# EAGLE design Titan_Balancer (EAGLE 9.6.2)

## Sheet 1 of 3: Connectors
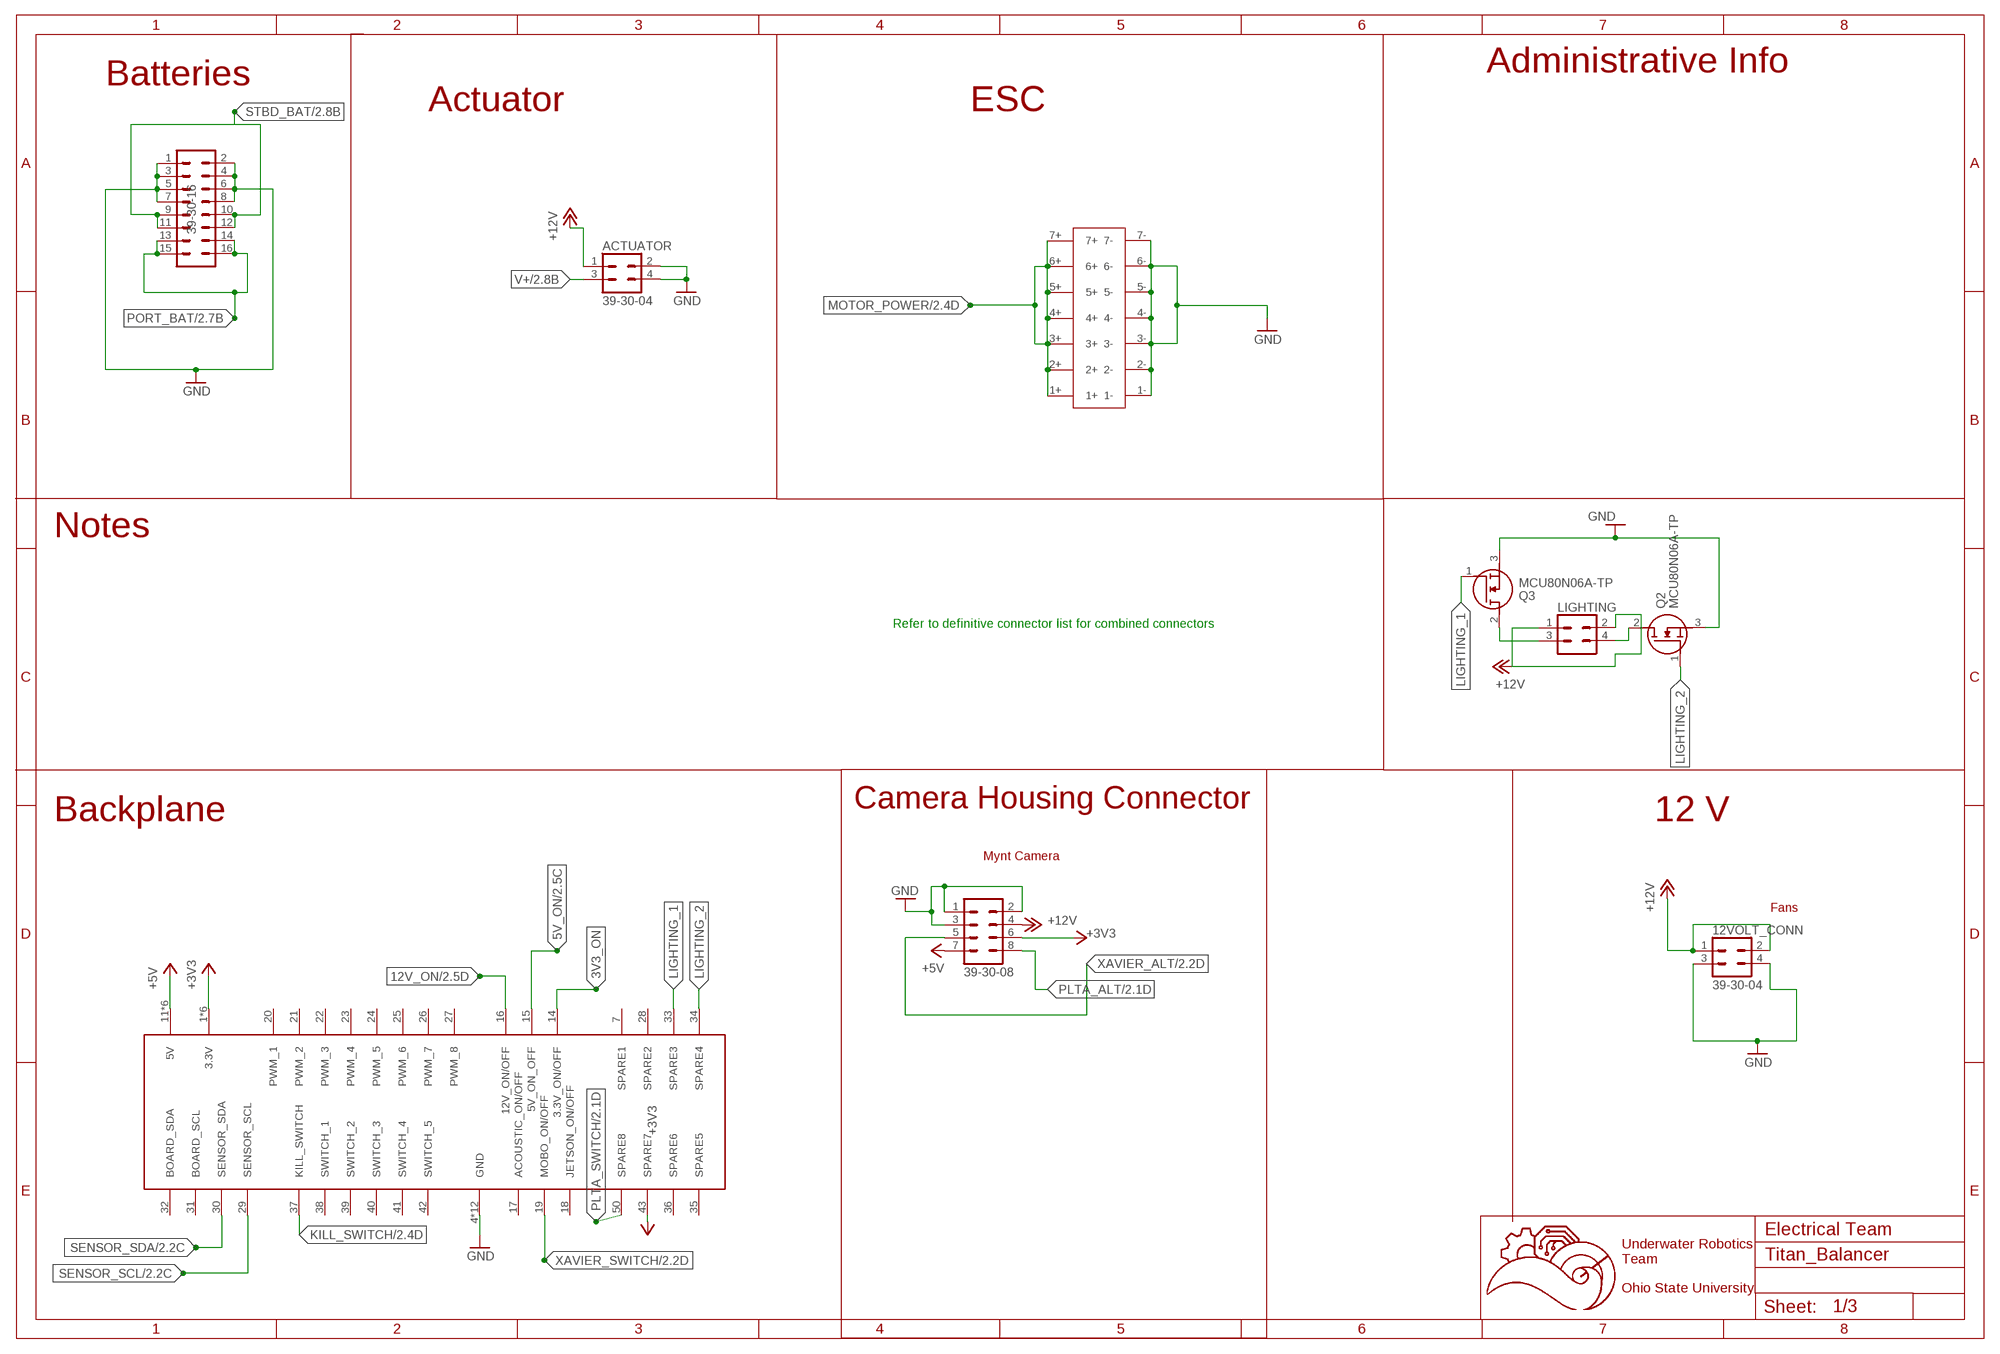
[diagram p0: schematic, sheet 1]

### Parts
12VOLT_CONN  39-30-04  [39-30-?04?]
ACTUATOR  39-30-04  [39-30-?04?]
BATTERYCONNECTOR  39-30-16  [39-30-?16?]
ESC_CONN  14PIN-VERT  [14PIN_VERT]
LIGHTING  39-30-04  [39-30-?04?]
MYNT_XAVIER_PLTA  39-30-08  [39-30-?08?]
Q2  MCU80N06A-TP  FDD8453LZ  [FDD8453LZ]
Q3  MCU80N06A-TP  FDD8453LZ  [FDD8453LZ]
U$1  5530843-EDGE  [5530843-6-BOARDFINGERS]

### Nets
3V3_ON: U$1.14(3.3V_ON/OFF)
5V_ON: U$1.15(5V_ON_OFF) ; also sheet 2
12V_ON: U$1.16(12V_ON/OFF) ; also sheet 2
+3V3: MYNT_XAVIER_PLTA.6 U$1.1(3.3V) U$1.2(3.3V) U$1.3(3.3V) U$1.43(SPARE7) U$1.54(3.3V) U$1.55(3.3V) U$1.56(3.3V) ; also sheet 2
+5V: MYNT_XAVIER_PLTA.7 U$1.11(5V) U$1.12(5V) U$1.13(5V) U$1.44(5V) U$1.45(5V) U$1.46(5V) ; also sheet 2
+12V: 12VOLT_CONN.1 12VOLT_CONN.2 ACTUATOR.1 LIGHTING.1 LIGHTING.2 MYNT_XAVIER_PLTA.4 ; also sheet 2
GND: 12VOLT_CONN.3 12VOLT_CONN.4 ACTUATOR.2 ACTUATOR.4 BATTERYCONNECTOR.1 BATTERYCONNECTOR.2 BATTERYCONNECTOR.3 BATTERYCONNECTOR.4 BATTERYCONNECTOR.5 BATTERYCONNECTOR.6 BATTERYCONNECTOR.7 BATTERYCONNECTOR.8 ESC_CONN.1- ESC_CONN.2- ESC_CONN.3- ESC_CONN.4- ESC_CONN.5- ESC_CONN.6- ESC_CONN.7- MYNT_XAVIER_PLTA.1 MYNT_XAVIER_PLTA.2 MYNT_XAVIER_PLTA.3 Q2.3(S) Q3.3(S) U$1.4(GND) U$1.5(GND) U$1.6(GND) U$1.8(GND) U$1.9(GND) U$1.10(GND) U$1.47(GND) U$1.48(GND) U$1.49(GND) U$1.51(GND) U$1.52(GND) U$1.53(GND) ; also sheet 2
KILL_SWITCH: U$1.37(KILL_SWITCH) ; also sheet 2
LIGHTING_1: Q3.1(G) U$1.33(SPARE3)
LIGHTING_2: Q2.1(G) U$1.34(SPARE4)
MOTOR_POWER: ESC_CONN.1+ ESC_CONN.2+ ESC_CONN.3+ ESC_CONN.4+ ESC_CONN.5+ ESC_CONN.6+ ESC_CONN.7+ ; also sheet 2
N$7: LIGHTING.3 Q3.2(D)
N$9: LIGHTING.4 Q2.2(D)
PLTA_ALT: MYNT_XAVIER_PLTA.8 ; also sheet 2
PLTA_SWITCH: U$1.50(SPARE8) ; also sheet 2
PORT_BAT: BATTERYCONNECTOR.13 BATTERYCONNECTOR.14 BATTERYCONNECTOR.15 BATTERYCONNECTOR.16 ; also sheet 2
SENSOR_SCL: U$1.29(SENSOR_SCL) ; also sheet 2
SENSOR_SDA: U$1.30(SENSOR_SDA) ; also sheet 2
STBD_BAT: BATTERYCONNECTOR.9 BATTERYCONNECTOR.10 BATTERYCONNECTOR.11 BATTERYCONNECTOR.12 ; also sheet 2
V+: ACTUATOR.3 ; also sheet 2
XAVIER_ALT: MYNT_XAVIER_PLTA.5 ; also sheet 2
XAVIER_SWITCH: U$1.19(MOBO_ON/OFF) ; also sheet 2
Unconnected: U$1.7(SPARE1) U$1.17(ACOUSTIC_ON/OFF) U$1.18(JETSON_ON/OFF) U$1.20(PWM_1) U$1.21(PWM_2) U$1.22(PWM_3) U$1.23(PWM_4) U$1.24(PWM_5) U$1.25(PWM_6) U$1.26(PWM_7) U$1.27(PWM_8) U$1.28(SPARE2) U$1.31(BOARD_SCL) U$1.32(BOARD_SDA) U$1.35(SPARE5) U$1.36(SPARE6) U$1.38(SWITCH_1) U$1.39(SWITCH_2) U$1.40(SWITCH_3) U$1.41(SWITCH_4) U$1.42(SWITCH_5)

### Notes on the sheet
- Administrative Info
- Batteries
- Actuator | ESC
- Notes
- Refer to definitive connector list for combined connectors
- Camera Housing Connector
- Backplane | 12 V
- Mynt Camera
- Fans
- Electrical Team
- Underwater Robotics
  Team
  
  Ohio State University

## Sheet 2 of 3: Battery Balancer
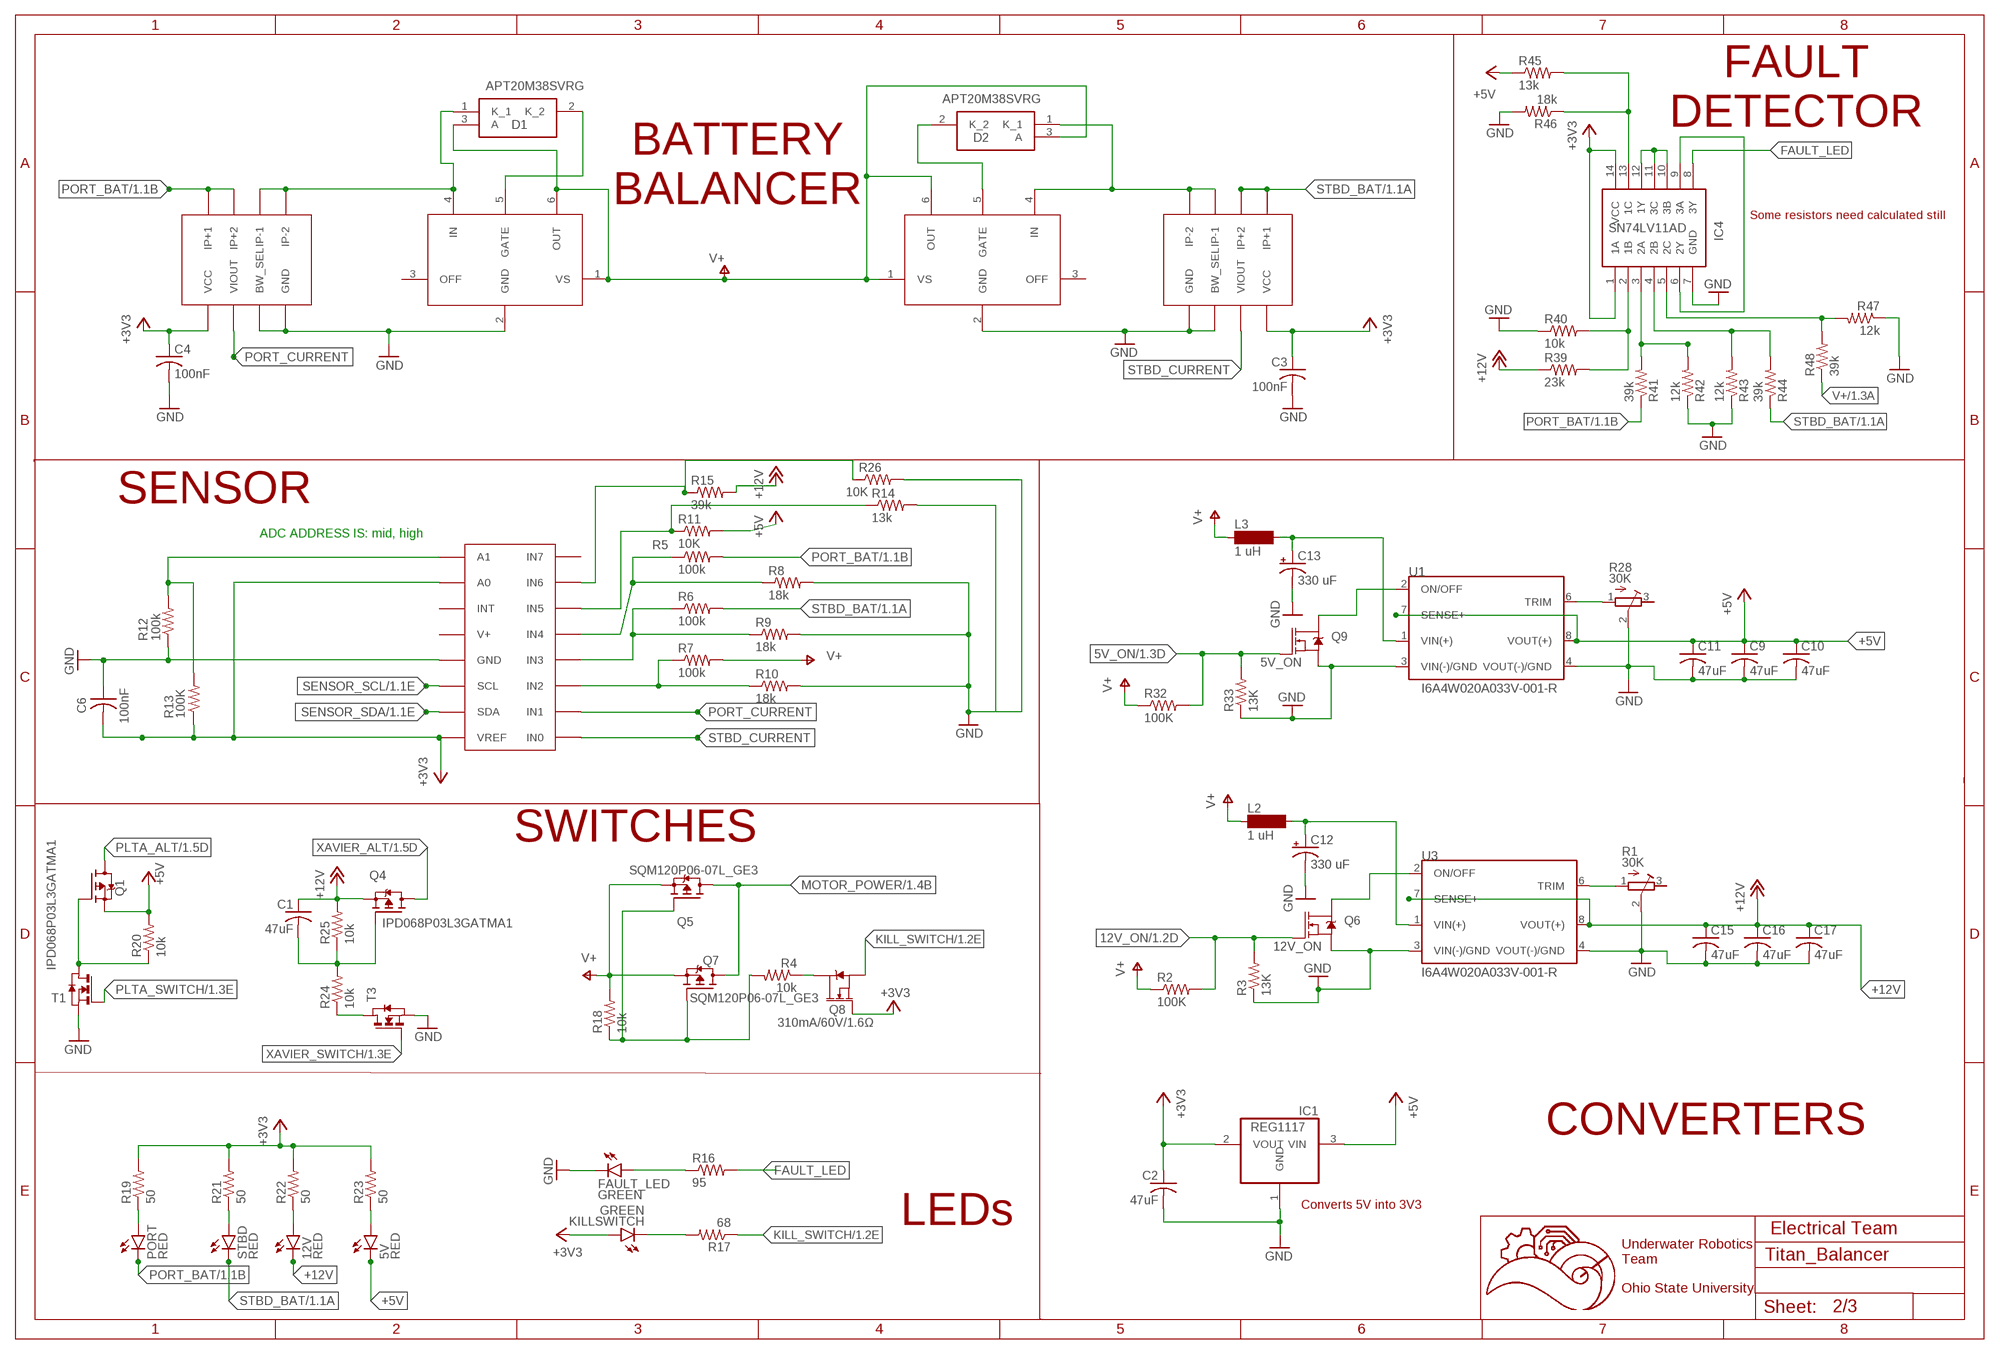
[diagram p1: schematic, sheet 2]

### Parts
5V  RED  LEDSML0603  [SML0603]
12V  RED  LEDSML0603  [SML0603]
C1  47uF  C-USC0603  [C0603]
C2  47uF  C-USC0603  [C0603]
C3  100nF  C-USC0603  [C0603]
C4  100nF  C-USC0603  [C0603]
C6  100nF  C-USC0603  [C0603]
C9  47uF  C-USC0603  [C0603]
C10  47uF  C-USC0603  [C0603]
C11  47uF  C-USC0603  [C0603]
C12  330 uF  CPOL-US153CLV-0810  [153CLV-0810]
C13  330 uF  CPOL-US153CLV-0810  [153CLV-0810]
C15  47uF  C-USC0603  [C0603]
C16  47uF  C-USC0603  [C0603]
C17  47uF  C-USC0603  [C0603]
D1  APT20M38SVRG  APT60DQ60SG  [APT60DQ60SG]
D2  APT20M38SVRG  APT60DQ60SG  [APT60DQ60SG]
FAULT_LED  GREEN  LEDSML0603  [SML0603]
IC1  REG1117  [SOT223]
IC4  SN74LV11AD  [SOIC127P600X175-14N]
KILLSWITCH  GREEN  LEDSML0603  [SML0603]
L2  1 uH  MS85  [MS85]
L3  1 uH  MS85  [MS85]
PORT  RED  LEDSML0603  [SML0603]
Q1  IPD068P03L3GATMA1  SPD30P06PTO252  [TO252]
Q4  IPD068P03L3GATMA1  SPD30P06PTO252  [TO252]
Q5  SQM120P06-07L_GE3  SPB80P06P  [TO263]
Q6  MOSFET-NCH-AO3404A  [SOT23-3]
Q7  SQM120P06-07L_GE3  SPB80P06P  [TO263]
Q8  310mA/60V/1.6Ω  MOSFET-NCH-2N7002PW  [SOT323]
Q9  MOSFET-NCH-AO3404A  [SOT23-3]
R1  30K  R-TRIMM3103  [RTRIM3103]
R2  100K  R-US_R0603  [R0603]
R3  13K  R-US_R0603  [R0603]
R4  10k  R-US_R0603  [R0603]
R5  100k  R-US_R0603  [R0603]
R6  100k  R-US_R0603  [R0603]
R7  100k  R-US_R0603  [R0603]
R8  18k  R-US_R0603  [R0603]
R9  18k  R-US_R0603  [R0603]
R10  18k  R-US_R0603  [R0603]
R11  10K  R-US_R0603  [R0603]
R12  100k  R-US_R0603  [R0603]
R13  100K  R-US_R0603  [R0603]
R14  13k  R-US_R0603  [R0603]
R15  39k  R-US_R0603  [R0603]
R16  95  R-US_R0603  [R0603]
R17  68  R-US_R0603  [R0603]
R18  10k  R-US_R0603  [R0603]
R19  50  R-US_R0603  [R0603]
R20  10k  R-US_R0603  [R0603]
R21  50  R-US_R0603  [R0603]
R22  50  R-US_R0603  [R0603]
R23  50  R-US_R0603  [R0603]
R24  10k  R-US_R0603  [R0603]
R25  10k  R-US_R0603  [R0603]
R26  10K  R-US_R0603  [R0603]
R28  30K  R-TRIMM3103  [RTRIM3103]
R32  100K  R-US_R0603  [R0603]
R33  13K  R-US_R0603  [R0603]
R39  23k  R-US_R0603  [R0603]
R40  10k  R-US_R0603  [R0603]
R41  39k  R-US_R0603  [R0603]
R42  12k  R-US_R0603  [R0603]
R43  12k  R-US_R0603  [R0603]
R44  39k  R-US_R0603  [R0603]
R45  13k  R-US_R0603  [R0603]
R46  18k  R-US_R0603  [R0603]
R47  12k  R-US_R0603  [R0603]
R48  39k  R-US_R0603  [R0603]
STBD  RED  LEDSML0603  [SML0603]
T1  NMOSSOT23  [SOT-23]
T3  NMOSSOT23  [SOT-23]
U1  I6A4W020A033V-001-R  [TDK-LAMBDA_I6A4W020A033V-001-R]
U3  I6A4W020A033V-001-R  [TDK-LAMBDA_I6A4W020A033V-001-R]
U$5  LM5050  [LM5050]
U$6  LM5050  [LM5050]
U$7  ACS722  [SOIC-8]
U$8  ACS722  [SOIC-8]
U$9  ADC128D818  [TSSOP-16]

### Nets
5V_ON: Q9.1(G) R32.2 R33.2 ; also sheet 1
12V_ON: Q6.1(G) R2.2 R3.2 ; also sheet 1
+3V3: C2.1 C3.1 C4.1 C6.2 IC1.2(VOUT) IC4.1(1A) IC4.14(VCC) KILLSWITCH.A Q8.1(G) R13.1 R19.2 R21.2 R22.2 R23.2 U$7.VCC U$8.VCC U$9.A0 U$9.VREF ; also sheet 1
+5V: 5V.C C9.1 C10.1 C11.1 IC1.3(VIN) Q1.2(S) R11.2 R20.2 R45.1 U1.7(SENSE+) U1.8(VOUT(+)) ; also sheet 1
+12V: 12V.C C1.1 C15.1 C16.1 C17.1 Q4.2(S) R15.2 R25.2 R39.1 U3.7(SENSE+) U3.8(VOUT(+)) ; also sheet 1
FAULT_LED: IC4.8(3Y) R16.2
GND: C2.2 C3.2 C4.2 C6.1 C9.2 C10.2 C11.2 C12.- C13.- C15.2 C16.2 C17.2 FAULT_LED.C IC1.1(GND) IC4.7(GND) Q6.2(S) Q9.2(S) R1.2(S) R3.1 R8.2 R9.2 R10.2 R12.1 R14.2 R26.2 R28.2(S) R33.1 R40.1 R42.1 R43.1 R46.2 R47.1 T1.2(S) T3.2(S) U1.3(VIN(-)/GND) U1.4(VOUT(-)/GND) U3.3(VIN(-)/GND) U3.4(VOUT(-)/GND) U$5.2(GND) U$6.2(GND) U$7.BW_SEL U$7.GND U$8.BW_SEL U$8.GND U$9.GND ; also sheet 1
KILL_SWITCH: Q8.2(S) R17.1 ; also sheet 1
MOTOR_POWER: Q5.3(D) Q7.3(D) ; also sheet 1
N$1: FAULT_LED.A R16.1
N$2: D2.2(K_2) U$6.5(GATE)
N$3: D1.1(K_1) U$5.4(IN) U$7.IP-1 U$7.IP-2
N$4: Q5.1(G) Q7.1(G) R4.2 R18.1
N$5: R5.1 R8.1 U$9.IN4
N$6: KILLSWITCH.C R17.2
N$8: Q1.1(G) R20.1 T1.1(D)
N$10: D1.2(K_2) U$5.5(GATE)
N$11: R6.1 R9.1 U$9.IN3
N$12: R7.1 R10.1 U$9.IN2
N$13: Q8.3(D) R4.1
N$14: R24.1 T3.1(D)
N$16: C1.2 Q4.1(G) R24.2 R25.1
N$17: R12.2 R13.2 U$9.A1
N$18: 5V.A R23.1
N$19: D2.1(K_1) U$6.4(IN) U$8.IP-1 U$8.IP-2
N$20: R1.1(A) U3.6(TRIM)
N$21: R28.1(A) U1.6(TRIM)
N$22: Q9.3(D) U1.2(ON/OFF)
N$23: 12V.A R22.1
N$24: C13.+ L3.2 U1.1(VIN(+))
N$25: R21.1 STBD.A
N$26: PORT.A R19.1
N$28: Q6.3(D) U3.2(ON/OFF)
N$29: C12.+ L2.2 U3.1(VIN(+))
N$30: IC4.2(1B) R39.2 R40.2
N$31: IC4.4(2B) R43.2 R44.2
N$32: IC4.13(1C) R45.2 R46.1
N$33: IC4.3(2A) R41.2 R42.2
N$34: IC4.5(2C) R47.2 R48.2
N$36: IC4.6(2Y) IC4.9(3A)
N$37: IC4.10(3B) IC4.11(3C) IC4.12(1Y)
N$39: R11.1 R14.1 U$9.IN5
N$40: R15.1 R26.1 U$9.IN6
PLTA_ALT: Q1.3(D) ; also sheet 1
PLTA_SWITCH: T1.3(G) ; also sheet 1
PORT_BAT: PORT.C R5.2 R41.1 U$7.IP+1 U$7.IP+2 ; also sheet 1
PORT_CURRENT: U$7.VIOUT U$9.IN1
SENSOR_SCL: U$9.SCL ; also sheet 1
SENSOR_SDA: U$9.SDA ; also sheet 1
STBD_BAT: R6.2 R44.1 STBD.C U$8.IP+1 U$8.IP+2 ; also sheet 1
STBD_CURRENT: U$8.VIOUT U$9.IN0
V+: D1.3(A) D2.3(A) L2.1 L3.1 Q5.2(S) Q7.2(S) R2.1 R7.2 R18.2 R32.1 R48.1 U$5.1(VS) U$5.6(OUT) U$6.1(VS) U$6.6(OUT) ; also sheet 1
XAVIER_ALT: Q4.3(D) ; also sheet 1
XAVIER_SWITCH: T3.3(G) ; also sheet 1
Unconnected: R1.3(E) R28.3(E) U$5.3(OFF) U$6.3(OFF) U$9.IN7 U$9.INT U$9.V+

### Notes on the sheet
- FAULT
  DETECTOR
- BATTERY
  BALANCER
- Some resistors need calculated still
- SENSOR
- ADC ADDRESS IS: mid, high
- SWITCHES
- CONVERTERS
- LEDs | Converts 5V into 3V3
- Electrical Team
- Underwater Robotics
  Team
  
  Ohio State University

## Sheet 3 of 3: Parts List
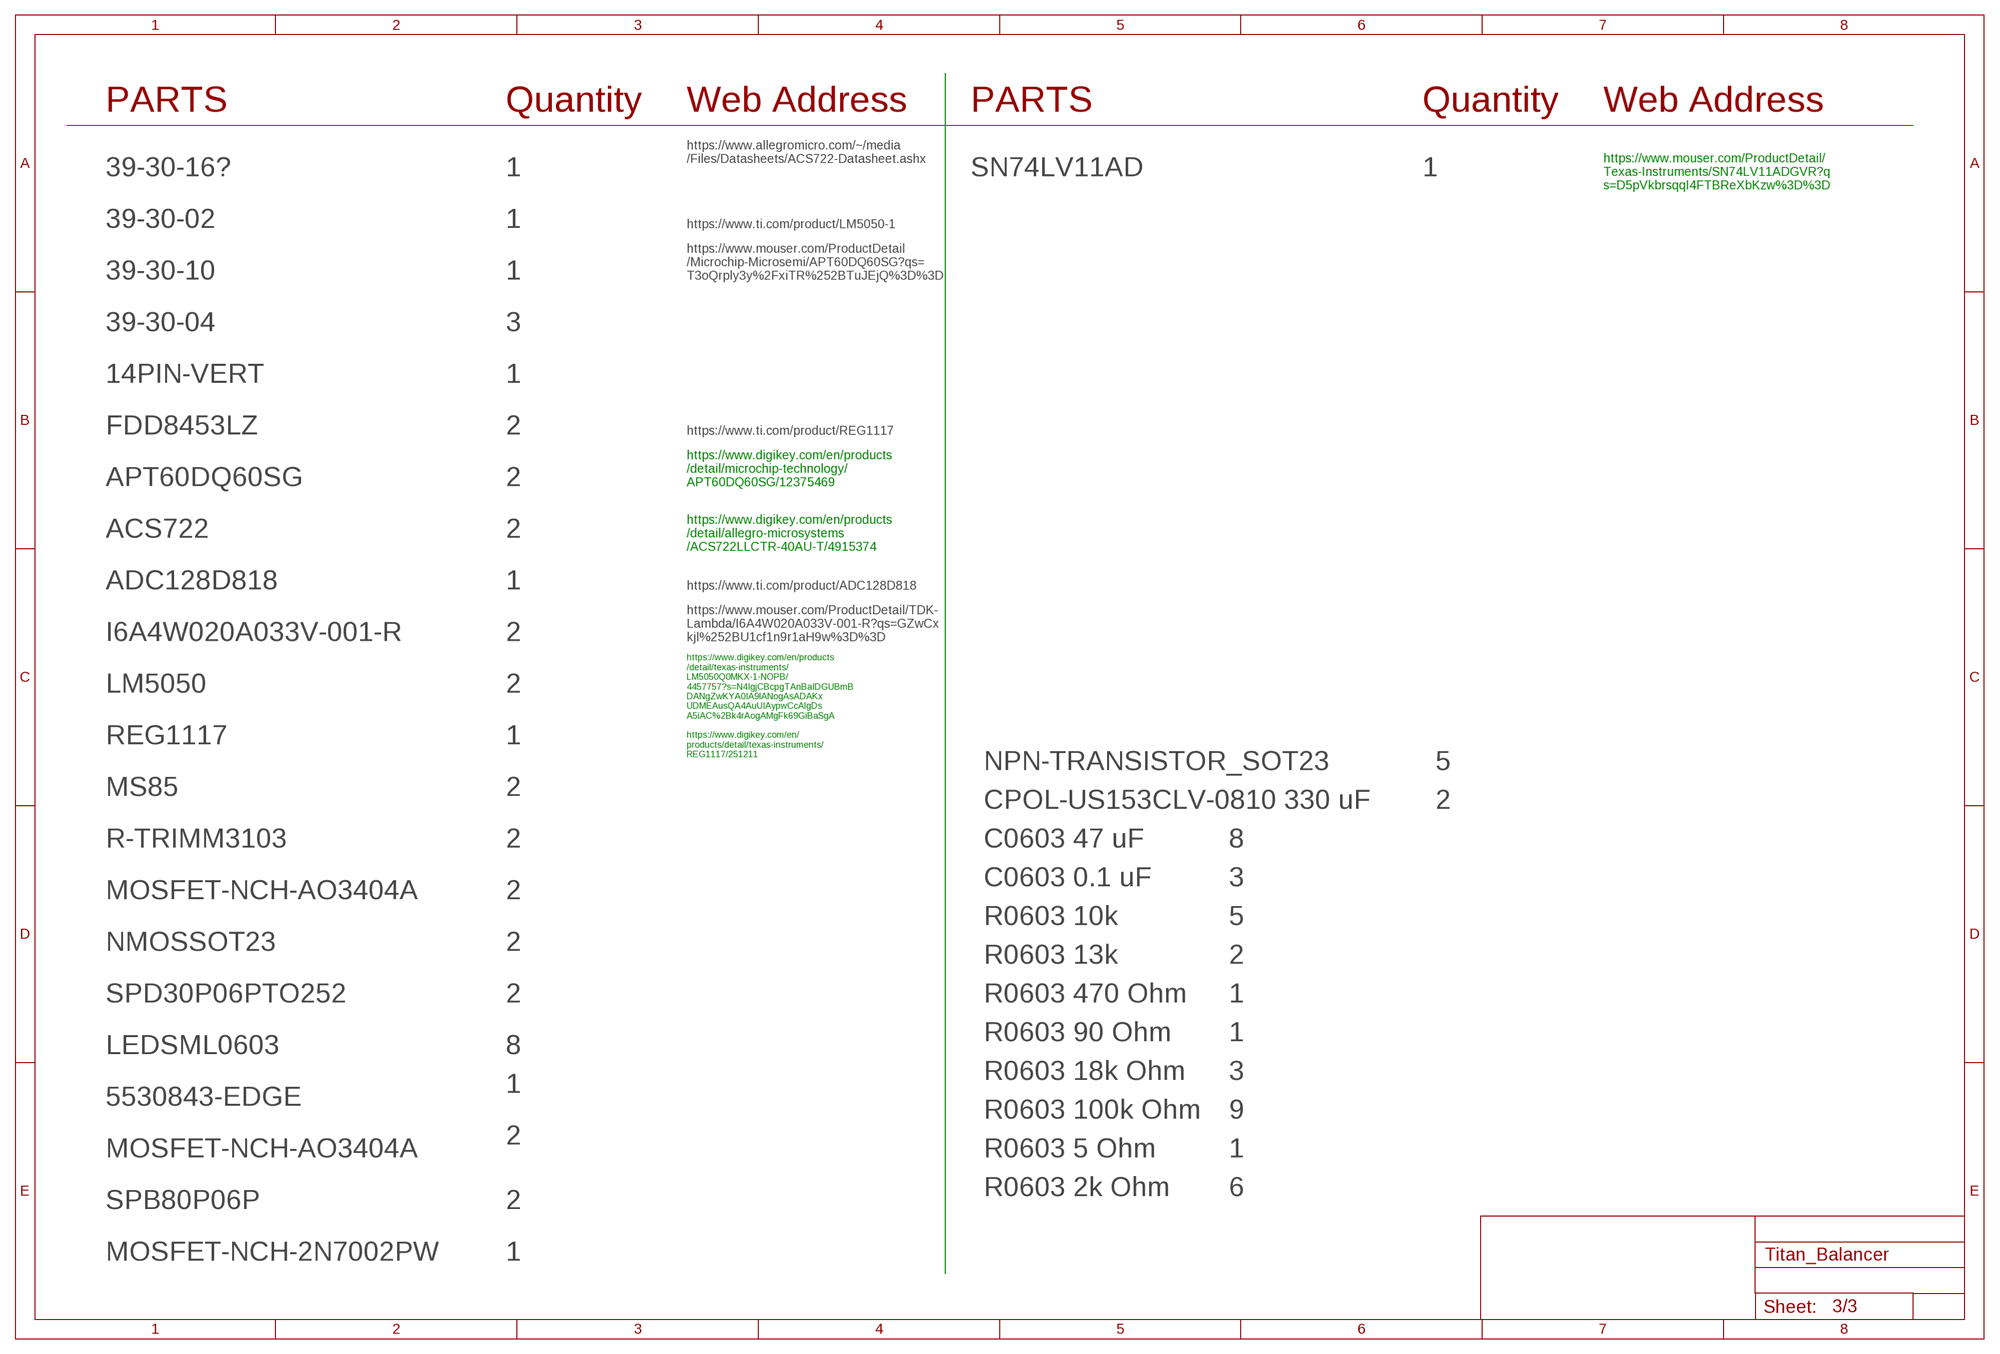
[diagram p2: schematic, sheet 3]

### Notes on the sheet
- PARTS | Quantity | Web Address | PARTS | Quantity | Web Address
- 39-30-16? | 1
- https://www.allegromicro.com/~/media
  /Files/Datasheets/ACS722-Datasheet.ashx
- SN74LV11AD | 1
- https://www.mouser.com/ProductDetail/
  Texas-Instruments/SN74LV11ADGVR?q
  s=D5pVkbrsqqI4FTBReXbKzw%3D%3D
- 39-30-02 | 1 | https://www.ti.com/product/LM5050-1
- 39-30-10 | 1
- https://www.mouser.com/ProductDetail
  /Microchip-Microsemi/APT60DQ60SG?qs=
  T3oQrply3y%2FxiTR%252BTuJEjQ%3D%3D
- 39-30-04 | 3
- 14PIN-VERT | 1
- FDD8453LZ | 2 | https://www.ti.com/product/REG1117
- APT60DQ60SG | 2
- https://www.digikey.com/en/products
  /detail/microchip-technology/
  APT60DQ60SG/12375469
- ACS722 | 2
- https://www.digikey.com/en/products
  /detail/allegro-microsystems
  /ACS722LLCTR-40AU-T/4915374
- ADC128D818 | 1 | https://www.ti.com/product/ADC128D818
- I6A4W020A033V-001-R | 2
- https://www.mouser.com/ProductDetail/TDK-
  Lambda/I6A4W020A033V-001-R?qs=GZwCx
  kjl%252BU1cf1n9r1aH9w%3D%3D
- LM5050 | 2
- https://www.digikey.com/en/products
  /detail/texas-instruments/
  LM5050Q0MKX-1-NOPB/
  4457757?s=N4IgjCBcpgTAnBaIDGUBmB
  DANgZwKYA0IA9lANogAsADAKx
  UDMEAusQA4AuUIAypwCcAlgDs
  A5iAC%2Bk4rAogAMgFk69GiBaSgA
- REG1117 | 1
- https://www.digikey.com/en/
  products/detail/texas-instruments/
  REG1117/251211
- NPN-TRANSISTOR_SOT23 | 5
- MS85 | 2
- CPOL-US153CLV-0810 330 uF | 2
- R-TRIMM3103 | 2 | C0603 47 uF | 8
- C0603 0.1 uF | 3
- MOSFET-NCH-AO3404A | 2
- R0603 10k | 5
- NMOSSOT23 | 2
- R0603 13k | 2
- SPD30P06PTO252 | 2 | R0603 470 Ohm | 1
- R0603 90 Ohm | 1
- LEDSML0603 | 8
- R0603 18k Ohm | 3
- 1
- 5530843-EDGE
- R0603 100k Ohm | 9
- 2
- MOSFET-NCH-AO3404A | R0603 5 Ohm | 1
- R0603 2k Ohm | 6
- SPB80P06P | 2
- MOSFET-NCH-2N7002PW | 1

## Library data of the parts
5V 12V FAULT_LED KILLSWITCH PORT STBD = led:LED: LED OSRAM: - CHIPLED LG R971, LG N971, LY N971, LG Q971, LY Q971, LO R971, LY R971 LH N974, LH R974 LS Q976, LO Q976, LY Q976 LO Q996 - Hyper CHIPLED LW Q18S LB Q993, LB Q99A, LB R99A - SideLED LS A670, LO A670, LY A670, LG A670, LP A670 LB A673, LV A673, LT A673, LW A673 LH A674 LY A675 LS A676, LA A676, LO A676, LY A676, LW A676 LS A679, LY A679, LG A679 - Hyper Micro SIDELED® LS Y876, LA Y876, LO Y876, LY Y876 LT Y87S - SmartLED LW L88C, LW L88S LB L89C, LB L89S, LG L890 LS L89K, LO L89K, LY L89K LS L896, LA L896, LO L896, LY L896 - TOPLED LS T670, LO T670, LY T670, LG T670, LP T670 LSG T670, LSP T670, LSY T670, LOP T670, LYG T670 LG T671, LOG T671, LSG T671 LB T673, LV T673, LT T673, LW T673 LH T674 LS T676, LA T676, LO T676, LY T676, LB T676, LH T676, LSB T676, LW T676 LB T67C, LV T67C, LT T67C, LS T67K, LO T67K, LY T67K, LW E67C LS E67B, LA E67B, LO E67B, LY E67B, LB E67C, LV E67C, LT E67C LW T67C LS T679, LY T679, LG T679 LS T770, LO T770, LY T770, LG T770, LP T770 LB T773, LV T773, LT T773, LW T773 LH T774 LS E675, LA E675, LY E675, LS T675 LS T776, LA T776, LO T776, LY T776, LB T776 LHGB T686 LT T68C, LB T68C - Hyper Mini TOPLED® LB M676 - Mini TOPLED Santana® LG M470 LS M47K, LO M47K, LY M47K Source: http://www.osram.convergy.de LUXEON: - LUMILED® LXK2-PW12-R00, LXK2-PW12-S00, LXK2-PW14-U00, LXK2-PW14-V00 LXK2-PM12-R00, LXK2-PM12-S00, LXK2-PM14-U00 LXK2-PE12-Q00, LXK2-PE12-R00, LXK2-PE12-S00, LXK2-PE14-T00, LXK2-PE14-U00 LXK2-PB12-K00, LXK2-PB12-L00, LXK2-PB12-M00, LXK2-PB14-N00, LXK2-PB14-P00, LXK2-PB14-Q00 LXK2-PR12-L00, LXK2-PR12-M00, LXK2-PR14-Q00, LXK2-PR14-R00 LXK2-PD12-Q00, LXK2-PD12-R00, LXK2-PD12-S00 LXK2-PH12-R00, LXK2-PH12-S00 LXK2-PL12-P00, LXK2-PL12-Q00, LXK2-PL12-R00 Source: www.luxeon.com KINGBRIGHT: KA-3528ASYC Source: www.kingbright.com
12VOLT_CONN ACTUATOR LIGHTING = con-molex-mini-fit:39-30-?04?: HEADER
BATTERYCONNECTOR = con-molex-mini-fit:39-30-?16?: HEADER
C1-C4 C6 C9-C11 C15-C17 = rcl:C-US: CAPACITOR, American symbol; SPICEPREFIX: C
C12 C13 = rcl:CPOL-US: POLARIZED CAPACITOR, American symbol; SPICEPREFIX: C
D1 D2 = APT60DQ60SG:APT60DQ60SG: Rectifiers FG, FRED, 600V, 60A, D3, TO-268, RoHS Source: Datasheet <https://www.microsemi.com/document-portal/doc_download/137560-apt60dq60sg-datasheet>; ARROW_PART_NUMBER: APT60DQ60SG; DESCRIPTION: Rectifiers FG, FRED, 600V, 60A, D3, TO-268, RoHS; HEIGHT: 5.1mm; MANUFACTURER_NAME: Microsemi Corporation; MANUFACTURER_PART_NUMBER: APT60DQ60SG; MOUSER_PART_NUMBER: 494-APT60DQ60SG; MOUSER_PRICE-STOCK: https://www.mouser.co.uk/ProductDetail/Microchip-Microsemi/APT60DQ60SG?qs=T3oQrply3y%2FxiTR%252BTuJEjQ%3D%3D
ESC_CONN = Vertical_Connectors:14PIN-VERT
IC1 = burr-brown:REG1117: 800mA and 1A Low Dropout (LDO) Positive Regulator 1.8V, 2.5V, 2.85V, 3.3V, 5V, and Adj; MPN: REG1117; OC_FARNELL: 1097566; OC_NEWARK: 14P6981
IC4 = SN74LV11AD:SN74LV11AD: AND Gate Triple 3-IN CMOS 14-Pin SOIC Texas Instruments SN74LV11AD, Triple 3-Input AND Logic Gate, 2 5.5 V, 14-Pin SOIC Source: Datasheet <http://www.ti.com/lit/ds/sces345d/sces345d.pdf>; ARROW_PART_NUMBER: SN74LV11AD; ARROW_PRICE-STOCK: https://www.arrow.com/en/products/sn74lv11ad/texas-instruments; DESCRIPTION: AND Gate Triple 3-IN CMOS 14-Pin SOIC Texas Instruments SN74LV11AD, Triple 3-Input AND Logic Gate, 2 5.5 V, 14-Pin SOIC; HEIGHT: 1.75mm; MANUFACTURER_NAME: Texas Instruments; MANUFACTURER_PART_NUMBER: SN74LV11AD; MOUSER_PART_NUMBER: 595-SN74LV11AD; MOUSER_PRICE-STOCK: https://www.mouser.co.uk/ProductDetail/Texas-Instruments/SN74LV11AD?qs=j01uVdFEFjF0ZgtTmp3b8A%3D%3D
L2 L3 = inductor-neosid:MS85: INDUCTOR SMD power inductor; OC_FARNELL: unknown; OC_NEWARK: unknown
MYNT_XAVIER_PLTA = con-molex-mini-fit:39-30-?08?: HEADER
Q1 Q4 = transistor-fet:SPD30P06P: SIPMOS(R) Power-Transistor P-Channel, Enhancement mode Source: http://www.infineon.com/upload/Document/cmc_upload/documents/012/3615/SPD_U30P06P.pdf
Q2 Q3 = FDD8453LZ:FDD8453LZ: FDD8453LZ N-Channel MOSFET, 16 A, 40 V PowerTrench, 3-Pin DPAK ON Semiconductor Source: Datasheet <https://www.onsemi.com/pub/Collateral/FDD8453LZ-D.pdf>; DESCRIPTION: FDD8453LZ N-Channel MOSFET, 16 A, 40 V PowerTrench, 3-Pin DPAK ON Semiconductor; HEIGHT: 2.39mm; MANUFACTURER_NAME: ON Semiconductor; MANUFACTURER_PART_NUMBER: FDD8453LZ; MOUSER_PART_NUMBER: 512-FDD8453LZ; MOUSER_PRICE-STOCK: https://www.mouser.com/Search/Refine.aspx?Keyword=512-FDD8453LZ
Q5 Q7 = transistor-fet:SPB80P06P: SIPMOS (R) Power-Transistor P-Channel, Enhancement mode Source: http://www.infineon.com/upload/Document/cmc_upload/documents/011/3685/SPP80P06P.pdf
Q6 Q9 = SparkFun-DiscreteSemi:MOSFET-NCH: N-channel MOSFETs Voltage controlled devices that allow control of high current outputs. SparkFun Products: SparkFun OpenScale <https://www.sparkfun.com/products/13261> SparkFun Digital Sandbox <https://www.sparkfun.com/products/12651> SparkFun Monster Moto Shield <https://www.sparkfun.com/products/10182> SparkFun MOSFET Power Controller <https://www.sparkfun.com/products/11214>; PROD_ID: TRANS-12988; VALUE: 5.8A/30V/35mΩ
Q8 = SparkFun-DiscreteSemi:MOSFET-NCH: N-channel MOSFETs Voltage controlled devices that allow control of high current outputs. SparkFun Products: SparkFun OpenScale <https://www.sparkfun.com/products/13261> SparkFun Digital Sandbox <https://www.sparkfun.com/products/12651> SparkFun Monster Moto Shield <https://www.sparkfun.com/products/10182> SparkFun MOSFET Power Controller <https://www.sparkfun.com/products/11214>; PROD_ID: TRANS-11151
R1 R28 = resistor:R-TRIMM: Trimm resistor
R2-R26 R32 R33 R39-R48 = rcl:R-US_: RESISTOR, American symbol; SPICEPREFIX: R
T1 T3 = zetex:NMOSSOT23: MOS FET; OC_FARNELL: unknown; OC_NEWARK: unknown
U1 U3 = I6A4W020A033V-001-R:I6A4W020A033V-001-R: Dc-Dc, Pcb Mount, Sixteenth Brick, Input 24vdc, Output 3.3-15v 20a, 250w, Neg Logic; DESCRIPTION: Non-Isolated PoL Module DC DC Converter 1 Output 3.3 ~ 15V 20A 9V - 53V Input; DIGI-KEY_PART_NUMBER: 285-2503-ND; MF: TDK-Lambda Americas; MOUSER-PURCHASE-URL: https://snapeda.com/shop?store=Mouser&id=1737324; MP: I6A4W020A033V-001-R; PACKAGE: DIP-7 TDK-Lambda
U$1 = 5530843-6:5530843-EDGE
U$5 U$6 = LM5050:LM5050
U$7 U$8 = ACS722:ACS722
U$9 = ADC128D818:ADC128D818

## Board
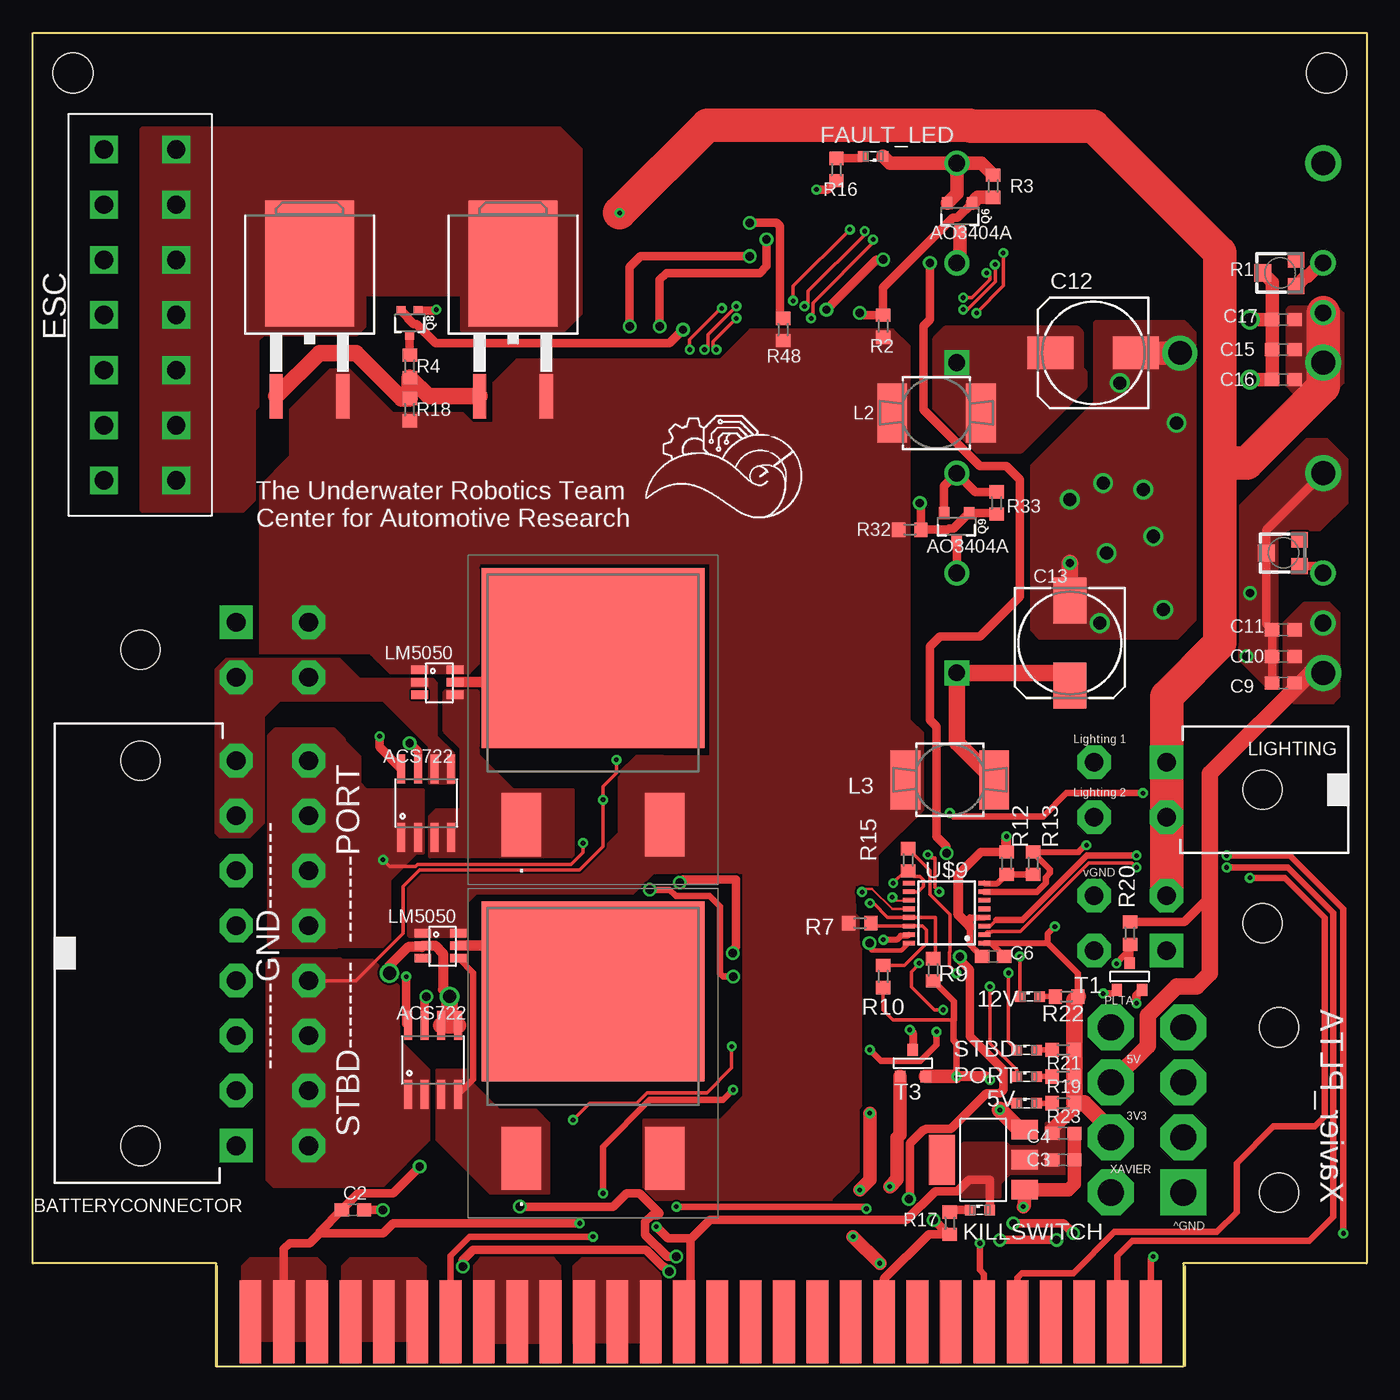
[diagram p3: board, top side]
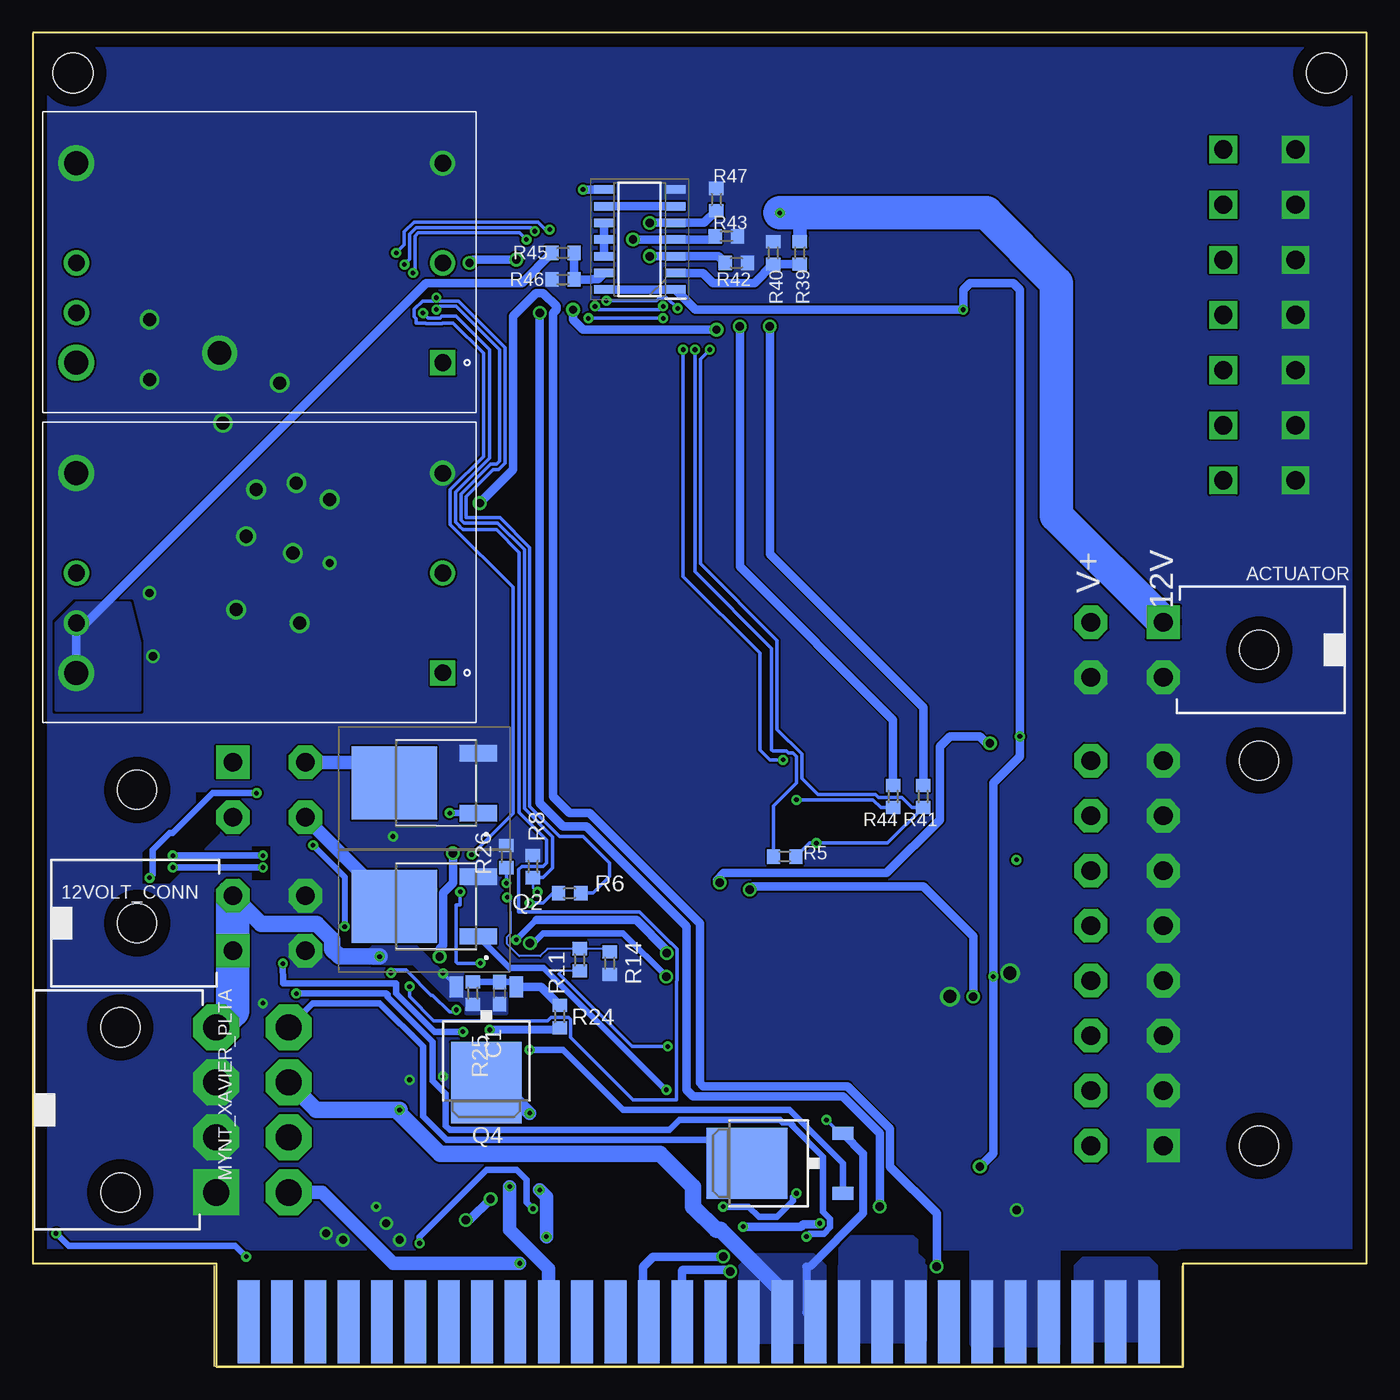
[diagram p4: board, bottom side, seen from below]

Size 101.6 x 101.6 mm. Coordinates in mm from the lower left corner, seen from the top.
Outline: 13.97,0 13.97,7.87 0,7.87 0,101.6 101.6,101.6 101.6,7.87 87.63,7.87 87.63,0 13.97,0
Copper layers (1*16): Top 0.035mm / dielectric 1.5mm / Bottom 0.035mm
Design rules "default": minimum track width 6mil, minimum drill 0.35mm, track to track 6mil, track to pad 6mil, pad to pad 6mil, via to via 6mil, smd to smd 6mil, copper to edge 40mil, drill to drill 6mil, minimum pad ring 10mil, minimum via ring 8mil, stop-mask expansion 4mil, vias tented up to drill 0mil, thermal gap 10mil
Holes 3.05 mm at 3.05,98.55 98.55,98.55

### Footprints (pad centres in the part's own frame; a part is rotated, then mirrored left to right if it is on the bottom)
SML0603 = smd 0.8 x 0.8: A 0.75,0; C -0.75,0
39-30-?04? = drill 1.422 pad 2.54 square: 1 2.095,0 | drill 1.422 pad 2.54 octagon: 2 -2.095,0; 3 2.095,5.512; 4 -2.095,5.512 | hole 3: 0,-7.3
39-30-?16? = drill 1.422 pad 2.54 square: 1 14.668,0 | drill 1.422 pad 2.54 octagon: 2 10.477,0; 3 6.287,0; 4 2.095,0; 5 -2.095,0; 6 -6.287,0; 7 -10.477,0; 8 -14.668,0; 9 14.668,5.512; 10 10.477,5.512; 11 6.287,5.512; 12 2.095,5.512; 13 -2.095,5.512; 14 -6.287,5.512; 15 -10.477,5.512; 16 -14.668,5.512 | hole 3: -14.668,-7.3; 14.668,-7.3
C0603 = smd 1.1 x 1: 1 -0.85,0; 2 0.85,0
153CLV-0810 = smd 3.5 x 2.5: + 3.25,0; - -3.25,0
APT60DQ60SG = smd 3 x 4.8: 1 -5.45,-11.55; 3 5.45,-11.55 | smd 17 x 13.7: 2 0,1.15
14PIN_VERT = drill 1.4 square: 1+ 0,0; 1- 5.5,0; 2+ 0,4.2; 2- 5.5,4.2; 3+ 0,8.4; 3- 5.5,8.4; 4+ 0,12.6; 4- 5.5,12.6; 5+ 0,16.8; 5- 5.5,16.8; 6+ 0,21; 6- 5.5,21; 7+ 0,25.2; 7- 5.5,25.2
SOT223 = smd 1.499 x 2.007: 1 -2.261,-3.15; 2 0.025,-3.15; 3 2.311,-3.15 | smd 3.81 x 2.007: 4 0,3.15
SOIC127P600X175-14N = smd 1.525 x 0.65: 1 -2.712,3.81; 2 -2.712,2.54; 3 -2.712,1.27; 4 -2.712,0; 5 -2.712,-1.27; 6 -2.712,-2.54; 7 -2.712,-3.81; 8 2.712,-3.81; 9 2.712,-2.54; 10 2.712,-1.27; 11 2.712,0; 12 2.712,1.27; 13 2.712,2.54; 14 2.712,3.81
MS85 = smd 4.5 x 2.25: 1 0,-3.383; 2 0,3.383
39-30-?08? = drill 2 pad 3.5 square: 1 6.287,0 | drill 2 pad 3.5 octagon: 2 2.095,0; 3 -2.095,0; 4 -6.287,0; 5 6.287,5.512; 6 2.095,5.512; 7 -2.095,5.512; 8 -6.287,5.512 | hole 3: -6.287,-7.3; 6.287,-7.3
TO252 = smd 1 x 1.6: 1 -2.28,-4.8; 2 2.28,-4.8 | smd 5.4 x 6.2: 3 0,2.5
FDD8453LZ = smd 1.25 x 2.85: 1 -2.28,-3.2; 3 2.28,-3.2 | smd 5.55 x 6.5: 2 0,3.2
TO263 = smd 1 x 3.4: 1 -2.54,-6.6; 2 2.54,-6.6 | smd 6.8 x 9.6: 3 0,3.5
SOT23-3 = smd 0.8 x 0.9: 1 -0.95,-1; 2 0.95,-1; 3 0,1.1
SOT323 = smd 0.7 x 0.7: 1 -0.65,-0.925; 2 0.65,-0.925; 3 0,0.925
RTRIM3103 = smd 1.2 x 1.25: 1 -1,-1.225; 3 1,-1.225 | smd 1.3 x 1.3: 2 0,1.3
R0603 = smd 1 x 1.1: 1 -0.85,0; 2 0.85,0
SOT-23 = smd 0.787 x 0.889: 1 0.025,-1.016; 2 -0.94,1.016; 3 0.991,1.016
TDK-LAMBDA_I6A4W020A033V-001-R = drill 1.274 square: 1 -13.95,7.6 | drill 1.274: 2 -13.95,0; 3 -13.95,-7.6; 6 13.95,0; 7 13.95,3.8 | drill 1.824: 4 13.95,-7.6; 8 13.95,7.6
5530843-6-BOARDFINGERS = smd 1.651 x 6.35 bottom: 1 0.826,3.375; 2 3.365,3.375; 3 5.905,3.375; 4 8.445,3.375; 5 10.986,3.375; 6 13.525,3.375; 7 16.066,3.375; 8 18.605,3.375; 9 21.145,3.375; 10 23.686,3.375; 11 26.226,3.375; 12 28.765,3.375; 13 31.305,3.375; 14 33.846,3.375; 15 36.386,3.375; 16 38.925,3.375; 17 41.465,3.375; 18 44.005,3.375; 19 46.545,3.375; 20 49.086,3.375; 21 51.626,3.375; 22 54.166,3.375; 23 56.706,3.375; 24 59.245,3.375; 25 61.785,3.375; 26 64.326,3.375; 27 66.865,3.375; 28 69.406,3.375 | smd 1.651 x 6.35: 29 69.406,3.375; 30 66.865,3.375; 31 64.326,3.375; 32 61.785,3.375; 33 59.245,3.375; 34 56.706,3.375; 35 54.166,3.375; 36 51.626,3.375; 37 49.086,3.375; 38 46.545,3.375; 39 44.005,3.375; 40 41.465,3.375; 41 38.925,3.375; 42 36.386,3.375; 43 33.846,3.375; 44 31.305,3.375; 45 28.765,3.375; 46 26.226,3.375; 47 23.686,3.375; 48 21.145,3.375; 49 18.605,3.375; 50 16.066,3.375; 51 13.525,3.375; 52 10.986,3.375; 53 8.445,3.375; 54 5.905,3.375; 55 3.365,3.375; 56 0.826,3.375
LM5050 = smd 0.635 x 1.27: 1 0,0; 2 0.95,0; 3 1.9,0; 4 1.9,2.7; 5 0.95,2.7; 6 0,2.7
SOIC-8 = smd 0.61 x 2.21: BW_SEL 0.635,2.616; GND 1.905,2.616; IP+1 -1.905,-2.616; IP+2 -0.635,-2.616; IP-1 0.635,-2.616; IP-2 1.905,-2.616; VCC -1.905,2.616; VIOUT -0.635,2.616
TSSOP-16 = smd 0.9 x 0.35: A0 -2.875,-1.625; A1 -2.875,-2.275; GND -2.875,0.325; IN0 2.875,2.275; IN1 2.875,1.625; IN2 2.875,0.975; IN3 2.875,0.325; IN4 2.875,-0.325; IN5 2.875,-0.975; IN6 2.875,-1.625; IN7 2.875,-2.275; INT -2.875,-0.975; SCL -2.875,0.975; SDA -2.875,1.625; V+ -2.875,-0.325; VREF -2.875,2.275

### Placement (x,y rotation side)
5V  75.69,20.07 0 top
12V  75.95,28.19 0 top
12VOLT_CONN  39-30-04?  [39-30-?04?]  86.36,33.78 270 bottom
ACTUATOR  39-30-04?  [39-30-?04?]  15.49,54.61 90 bottom
BATTERYCONNECTOR  39-30-16?  [39-30-?16?]  15.49,31.5 270 top
C1  66.04,28.45 90 bottom
C2  24.38,11.94 0 top
C3  78.49,15.75 0 top
C4  78.49,17.78 0 top
C6  73.15,31.24 0 top
C9  95.25,52.07 180 top
C10  95.25,54.1 180 top
C11  95.25,56.13 180 top
C12  80.77,77.22 180 top
C13  78.99,55.12 270 top
C15  95.25,77.47 180 top
C16  95.25,75.18 180 top
C17  95.25,79.76 180 top
D1  42.67,52.83 0 top
D2  42.67,27.43 0 top
ESC_CONN  10.92,92.71 180 top
FAULT_LED  64.01,92.2 180 top
IC1  72.39,15.75 90 top
IC4  55.37,85.85 180 bottom
KILLSWITCH  72.14,11.94 0 top
L2  68.83,72.64 270 top
L3  69.85,44.7 270 top
LIGHTING  39-30-04?  [39-30-?04?]  86.36,43.94 90 top
MYNT_XAVIER_PLTA  39-30-08?  [39-30-?08?]  87.63,19.56 270 bottom
PORT  75.69,22.1 0 top
Q1  44.7,15.49 90 bottom
Q2  70.87,35.05 90 bottom
Q3  70.87,44.45 90 bottom
Q4  67.06,24.13 180 bottom
Q5  21.08,80.52 0 top
Q6  70.61,87.63 180 top
Q7  36.58,80.52 0 top
Q8  28.7,79.5 180 top
Q9  70.36,64.01 180 top
R1  95,83.31 90 top
R2  64.77,79.25 90 top
R3  73.15,89.92 270 top
R4  28.7,76.2 270 top
R5  44.32,38.86 0 bottom
R6  60.71,36.07 0 bottom
R7  62.99,33.78 180 top
R8  63.5,38.1 90 bottom
R9  68.58,30.23 270 top
R10  64.77,29.72 270 top
R11  59.94,30.99 270 bottom
R12  74.17,38.35 270 top
R13  76.2,38.35 270 top
R14  57.66,30.73 270 bottom
R15  66.67,38.61 90 top
R16  61.21,91.19 270 top
R17  69.85,10.92 90 top
R18  28.7,72.9 270 top
R19  78.49,22.1 0 top
R20  83.57,33.02 90 top
R21  78.49,24.13 0 top
R22  78.74,28.19 0 top
R23  78.49,20.07 0 top
R24  61.47,26.67 90 bottom
R25  68.07,28.45 270 bottom
R26  65.53,38.86 90 bottom
R28  95.25,61.98 90 top
R32  66.8,63.75 0 top
R33  73.41,65.79 270 top
R39  43.18,84.84 270 bottom
R40  45.21,84.84 270 bottom
R41  33.78,43.43 90 bottom
R42  48.01,84.07 180 bottom
R43  48.77,86.11 180 bottom
R44  36.07,43.43 90 bottom
R45  61.21,84.84 0 bottom
R46  61.21,82.8 180 bottom
R47  49.53,88.9 270 bottom
R48  57.15,78.99 90 top
STBD  75.69,24.13 0 top
T1  83.57,29.72 180 top
T3  67.06,23.11 180 top
U1  84.33,60.45 180 bottom
U3  84.33,84.07 180 bottom
U$1  15.76,0.05 0 top
U$5  29.46,53.09 270 top
U$6  29.72,33.02 270 top
U$7  29.97,42.93 0 top
U$8  30.48,23.37 0 top
U$9  69.6,34.54 180 top

### Tracks (layer width: path | path; a pad name or v marks a point on that pad's centre or on a via)
5V_ON  (via drill 0.64)
  Top 0.635: R33.2 73.33,65.01 Q9.1 70.13,63.83 69.76,63.83 69.69,63.75 R32.2 67.65,65.7 v67.56,65.79 | v48.47,7.25 48.12,7.59 48,7.59 46.71,8.89 33.53,8.89 32.75,8.1 v32.75,7.62
  Bottom 0.635: U$1.15 52.14,7.29 52.07,7.37 48.59,7.37 v48.47,7.25 | v32.75,7.62 32.75,11.67 36.3,15.21 36.3,18.11 39.55,21.36 50.55,21.36 50.8,21.61 50.8,33.78 59.18,42.16 60.71,42.16 61.98,43.43 61.98,80.26 61.72,80.52 61.72,80.77 62.74,81.78 63.25,81.78 65.02,80.01 65.02,68.33 v67.56,65.79
12V_ON  (via drill 0.64)
  Top 0.635: Q6.1 70.44,87.51 70.08,87.51 64.77,82.2 R2.2 63.16,80.1 v62.99,80.26 | v37.08,12.19 44.2,12.19 45.21,13.21 46.23,13.21 47.75,11.68 47.58,11.52 47.15,11.52 46.65,11.02 46.65,10.06 48.33,8.38 v49.02,8.38
  Top 1.016: Q6.1 72,89.07 R3.2
  Bottom 0.635: v37.08,12.19 37.08,17.78 39.88,20.57 51.31,20.57 51.82,21.08 51.82,33.53 59.44,41.15 61.21,41.15 62.99,42.93 v62.99,80.26 | v49.02,8.38 54.36,8.38 55.12,7.62 55.12,3.86 U$1.16
+3V3  (via drill 0.35, 0.64)
  Top 0.457: U$9.VREF 72.97,32.27 | 72.97,32.27 C6.2 | 72.97,32.27 77.29,32.27 | 77.29,32.27 79.59,29.97 | R13.1 79.65,39.2 80.01,39.57 80.11,39.57 v80.26,39.72 | v77.85,33.53 77.29,32.97 77.29,32.27
  Top 0.508: 79.59,29.97 R22.2 | R13.1 76.2,39.13 77.47,37.86 77.47,37.59 77.16,37.28 77.16,36.84 76.49,36.17 U$9.A0
  Top 0.635: KILLSWITCH.A 72.89,14.24 71.3,14.24 70.44,13.37 68.75,13.37 66.55,11.18 51.56,11.18 50.16,9.78 | U$1.43 50.11,3.93 50.11,9.72 50.16,9.78 | v30.73,80.52 30.64,80.43 Q8.1 | U$7.VCC 26.42,47.19 v26.42,48.01 | U$8.VCC 28.45,26.11 v28.45,29.72 | 50.16,9.78 48.39,9.78 v47.5,10.67 | v41.66,10.92 27.43,10.92 26.67,10.16 21.84,10.16 | 21.84,10.16 21.8,10.2 C2.1 24.21,12.62 24.21,12.63 24.79,13.21 27.43,13.21 v29.46,15.24 | 21.84,10.16 21.08,9.4 19.56,9.4 19.12,8.96 U$1.2
  Top 0.762: R21.2 R19.2
  Top 1.016: R23.2 79.48,19.92 77.64,18.08 C4.1
  Top 1.27: R22.2 79.34,27.94 R21.2 R23.2 80.1,20.07 82.12,18.05 MYNT_XAVIER_PLTA.6
  Bottom 0.457: v80.26,39.72 77.85,37.3 v77.85,33.53
  Bottom 0.635: IC4.14 IC4.1 51.14,80.52 v30.73,80.52 30.73,82.04 30.23,82.55 26.92,82.55 26.42,82.04 v26.42,48.01 26.42,46.48 28.45,44.45 v28.45,29.72 28.45,16.26 v29.46,15.24 | v47.5,10.67 43.11,10.67 42.92,10.86 41.72,10.86 v41.66,10.92
  pour Bottom (no thermals): 15.93,7.67 16.57,8.3 21.65,8.3 22.28,7.67 22.28,1.95 15.93,1.95
  pour Top (no thermals): 15.93,7.67 16.57,8.3 21.65,8.3 22.28,7.67 22.28,1.95 15.93,1.95
  pour Top (no thermals): 78.74,14.73 78.74,18.54 77.22,18.54 77.22,17.53 76.45,16.76 74.42,16.76 74.17,17.02 70.87,17.02 70.87,12.95 73.66,12.95 73.66,13.97 74.42,14.73
+5V  (via drill 0.35)
  Top 0.254: 5V.C 74.17,20.07 v73.66,19.56 | v53.24,24.38 53.24,22.76 51.33,20.85 46.77,20.85 45.98,20.07 42.42,20.07 v41.15,18.8
  Top 0.635: 89.66,35.81 87.72,33.87 R20.2
  Top 1.27: U1.8 97.35,52.85 89.66,45.17 89.66,40.13 89.66,35.81 89.66,29.97 88.65,28.96 87.12,28.96 84.91,26.75 84.91,24.45 MYNT_XAVIER_PLTA.7 | v73.66,19.56 75.16,18.06 IC1.3
  Bottom 0.152: R11.2 61.3,30.14 61.5,29.94
  Bottom 0.254: v53.24,24.38 55.95,24.38 61.5,29.94 | v41.15,18.8 40.13,17.77 Q1.2
  Bottom 0.61: Q1.2 38.35,16.22 38.35,11.68 42.42,7.62 42.67,7.62 42.67,4.11 U$1.46
  Bottom 0.635: R45.1 64.35,82.55 71.63,82.55 98.28,55.9 U1.8
  Bottom 1.27: U$1.12 44.52,5.73 49.2,10.41 49.53,10.41 51.31,12.19 51.31,13.72 53.81,16.22 70.59,16.22 73.66,19.29 v73.66,19.56 80.02,19.56 MYNT_XAVIER_PLTA.7
  pour Top (no thermals): 41.2,1.83 41.2,7.67 41.84,8.3 47.17,8.3 47.81,7.67 47.81,1.83
  pour Bottom (no thermals): 41.2,1.83 41.2,7.67 42.09,8.56 46.92,8.56 47.81,7.67 47.81,1.83
  pour Top (no thermals): 96.77,58.17 95.25,56.64 95.25,51.31 96.01,50.55 99.06,50.55 99.57,51.05 99.57,57.4 98.81,58.17
  pour Bottom (no thermals): 93.47,55.12 93.47,50.04 99.82,50.04 99.82,56.64 98.3,58.17 94.23,58.17
+12V  (via drill 0.35)
  Top 0.254: 12V.C 75.2,31.23 v75.18,31.24 | R15.2 68.32,37.81 68.32,35.97 69.85,34.45 69.85,34.12 69.85,31.61 69.81,31.57 69.81,30.52 v70.36,29.97
  Top 2.54: v44.7,87.88 51.38,94.56 71.36,94.56 71.44,94.49 80.77,94.49 90.42,84.84 90.42,68.83 | 90.42,68.83 92.46,68.83 98.28,74.66 U3.8 U3.7 | 90.42,68.83 90.42,55.12 86.36,51.05 LIGHTING.1 LIGHTING.2 12VOLT_CONN.2
  Bottom 0.254: Q4.2 69.34,28.95 v70.36,29.97
  Bottom 1.016: R39.1 43.18,87.63 42.93,87.88
  Bottom 1.27: v75.18,31.24 78.23,31.24 78.79,31.8 78.79,32.54 80,33.74 84.23,33.74 12VOLT_CONN.2
  Bottom 2.54: 12VOLT_CONN.2 12VOLT_CONN.1 86.36,27.11 MYNT_XAVIER_PLTA.4 | ACTUATOR.1 23.62,64.83 23.62,82.55 28.96,87.88 42.93,87.88 v44.7,87.88
  pour Top (no thermals): 95.76,80.77 99.31,80.77 99.82,80.26 99.82,74.93 99.06,74.17 96.01,74.17 95.5,74.68 95.5,80.52
  pour Bottom (no thermals): 65.53,28.19 65.53,26.92 68.58,26.92 68.58,27.43 69.09,27.94 69.85,27.94 72.64,30.73 75.69,30.73 75.95,30.99 75.95,31.75 75.69,32 72.39,32 70.36,29.97 68.83,29.97 68.83,28.7 68.58,28.45 65.53,28.45
CUT
  cutout Top: 64.52,34.54 63.5,34.54 62.74,35.31 62.74,36.58 65.02,36.58 64.52,36.07
  cutout Bottom (no thermals): 92.96,36.83 91.19,36.83 87.38,40.64 87.38,43.18 87.88,43.69 89.15,43.69 89.15,39.88 89.41,39.62 92.71,39.62 93.22,39.12 93.22,36.83
  cutout Bottom (no thermals): 84.84,39.62 83.57,39.62 83.57,37.08 84.84,37.08
  cutout Top (no thermals): 63.25,12.7 63.25,32.51 63.5,32.77 64.01,32.77 64.26,33.02 64.77,33.02 64.77,11.18
  cutout Top (no thermals): 62.74,35.31 62.74,34.54 62.99,34.29 62.99,32.77 62.99,32.51 63.25,32.26 63.5,32.26 64.52,33.27 64.52,34.54 63.75,35.31
  cutout Top (no thermals): 63.25,14.99 61.98,13.72 61.98,12.45 63.5,12.45 63.5,14.99
  cutout Top (no thermals): 61.98,13.72 60.96,12.7 60.96,12.45 62.23,12.45 62.23,13.72
FAULT_LED  (via drill 0.35)
  Top 0.635: R16.2 60.54,89.66 v59.69,89.66
  Bottom 0.635: v59.69,89.66 IC4.8
GND  (via drill 0.35, 0.6, 0.64, 1, 1.78)
  Top 0.254: R10.2 64.77,27.18 65.53,26.42 70.1,26.42 70.14,26.42
  Top 0.457: 71.37,34.22 U$9.GND
  Top 0.508: v70.36,22.1 70.36,24.64 70.1,24.89 70.1,26.42 | R9.2 70.14,27.81 70.14,26.42 | C6.1 71.86,31.69 71.85,31.69 71.37,32.17 71.37,33.53 71.37,34.22
  Top 0.635: T1.2 84.07,28.27 v84.07,27.69 | R33.1 71.79,66.64 U1.3 69.41,67.08 Q9.2 | U1.4 93.95,63.72 R28.2 93.95,56.58 C11.2 C10.2 C9.2 | C2.2 v26.67,11.94 | R12.1 72.22,39.2 70.61,37.59 | v74.68,10.92 78.49,10.92 v79.25,10.16 | v73.66,9.65 v77.98,9.65
  Top 0.762: R12.1 v74.17,40.39 | v31.75,28.19 31.24,28.7 31.24,31.5 30.67,32.07 U$6.2 29.62,31.97 28.59,31.97 27.17,30.55 v27.17,29.97 | v70.36,22.1 72.64,22.1 v72.9,21.84 | 71.37,33.53 70.51,34.39 70.51,37.49 70.61,37.59
  Top 1.016: C17.2 v92.71,79.76 | v92.71,75.18 C16.2 C15.2 C17.2 | R1.2 94.4,82.61 C17.2 | U3.3 72.24,91.67 R3.1 | U3.3 70.38,89.35 Q6.2 | U3.3 65.29,91.67 FAULT_LED.C | C4.2 C3.2 79.34,13.94 78.88,13.49 IC1.1 75.54,12.29 v75.44,12.19 | T3.2 v70.36,22.1
  Top 1.27: C13.- v78.99,61.21 | U$8.GND 31.75,25.98 | 31.75,25.98 U$8.BW_SEL | 31.75,25.98 v31.75,28.19
  Top 1.778: C12.- v87.38,77.22
  other vias: 92.46,54.1 92.71,58.93 81.53,67.31 78.99,66.04 84.58,66.8 85.34,63.25 81.79,61.98 81.28,56.64 86.11,57.66 87.12,71.88 82.8,74.93
  pour Top (no thermals): 23.55,7.67 24.19,8.3 29.27,8.3 29.9,7.67 29.9,1.95 23.55,1.95
  pour Bottom (no thermals): 23.55,7.67 24.19,8.3 29.27,8.3 29.9,7.67 29.9,1.95 23.55,1.95
  pour Top (no thermals): 33.71,1.83 40.19,1.83 40.19,7.67 39.68,8.3 34.09,8.3 33.58,7.67 33.58,1.95
  pour Bottom (no thermals): 33.58,7.67 33.58,1.95 33.71,1.83 40.06,1.83 40.06,5.76 40.19,5.89 40.19,7.67 39.68,8.3 34.09,8.3
  pour Bottom (rank 6, no thermals): -7.37,107.19 -7.37,12.45 -3.81,8.89 108.71,8.89 108.71,105.66 105.16,109.22 -5.33,109.22
  pour Bottom (no thermals): 33.78,7.37 33.78,8.13 34.29,8.64 34.29,9.65 34.54,9.91 40.13,9.91 40.13,7.11 39.88,6.86 33.78,6.86
  pour Top (no thermals): 94.74,51.82 93.98,51.82 91.95,53.85 91.95,55.88 91.95,65.53 97.03,70.61 98.55,70.61 100.08,69.09 100.08,65.79 98.04,63.75 97.28,63.75 95.5,63.75 94.74,62.99 94.74,56.13
  pour Bottom (no thermals): 29.97,1.78 29.97,9.14 28.96,10.16 24.13,10.16 23.62,9.65 23.62,4.57 23.62,1.78
  pour Top (no thermals): 30.23,47.24 30.23,44.45 32,44.45 32,46.74 30.73,48.01 30.73,52.07 30.48,52.32 24.89,52.32 23.37,53.85 14.73,53.85 13.97,53.09 13.97,40.64 14.22,40.39 16.51,40.39 17.53,41.4 17.53,49.53 18.8,50.8 26.67,50.8
  pour Top (no thermals): 81.03,76.2 81.03,79.5 87.63,79.5 87.88,79.25 88.39,78.74 88.39,58.17 88.39,56.9 87.12,55.63 76.71,55.63 76.2,56.13 76.2,68.58 79.76,72.14 80.77,73.15 81.03,73.41
KILL_SWITCH  (via drill 0.64)
  Top 0.635: U$1.37 64.84,6.68 68.24,10.07 R17.1 69.73,10.07 v68.63,11.18 | Q8.2 28.53,79.95 28.53,79.88 29.02,79.4 29.25,79.4 30.67,77.98 48.51,77.98 v49.53,78.99 | v60.45,80.52 64.26,84.33 v64.77,84.33 | v68.33,84.07 68.33,79.76 67.82,79.25 67.82,72.9 72.14,68.58 74.17,68.58 75.18,67.56 75.18,58.67 72.14,55.63 69.09,55.63 68.33,54.86 68.33,49.28 68.83,48.77 68.83,40.39 69.6,39.62 v69.6,39.12 | v66.74,12.77 66.8,12.7 66.8,17.02 67.82,18.03 67.95,18.03 68.04,18.12 69.94,18.12 72.64,20.83 73.66,20.83 73.91,21.08 73.91,22.61 71.37,25.15 71.37,30.23 70.61,30.99 v70.61,31.24
  Bottom 0.635: v49.53,78.99 59.69,78.99 60.45,79.76 v60.45,80.52 | v64.77,84.33 68.07,84.33 v68.33,84.07 | v69.6,39.12 69.6,36.83 70.35,36.08 70.35,32.08 70.61,31.82 v70.61,31.24 | v66.74,12.77 68.33,11.18 v68.63,11.18
LIGHTING_1  (via drill 0.35)
  Top 0.508: U$1.33 75,6.78 75.34,7.11 79.25,7.11 82.4,10.26 90.19,10.26 91.69,11.77 91.69,15.49 94.49,18.29 97.64,18.29 98.4,19.05 98.4,34.19 95.35,37.24 v92.71,37.24 | v69.85,42.16 70.1,41.91 76.96,41.91 78.74,43.69 v84.56,43.69
  Bottom 0.508: Q3.1 v69.84,42.17 v69.85,42.16 | v84.56,43.69 87.88,43.69 90.93,40.64 91.19,40.64 92.46,39.37 92.46,37.5 v92.71,37.24
LIGHTING_2  (via drill 0.35)
  Top 0.508: v53.34,21.08 52.58,20.32 46.99,20.32 43.43,16.76 v43.43,13.21 | v49.02,12.19 63.33,12.19 v63.5,12.02 | v72.14,9.4 72.14,7.37 72.46,7.04 72.46,4.14 72.39,4.06 72.39,3.49 U$1.34
  Bottom 0.508: Q2.1 65.28,30.39 62.71,30.39 53.41,21.08 v53.34,21.08 | v43.43,13.21 43.7,12.94 43.7,12.63 44.92,11.41 46.3,11.41 47.08,12.19 v49.02,12.19 | v63.5,12.02 64.01,12.53 64.01,14.22 64.77,14.99 67.06,14.99 72.14,9.91 v72.14,9.4
MOTOR_POWER
  pour Top (no thermals): 40.39,78.99 32.77,78.99 32.77,81.79 25.15,81.79 25.15,79.25 24.64,78.74 17.53,78.74 17.02,78.23 17.02,73.15 16.76,72.9 16.76,66.04 16,65.28 8.38,65.28 8.38,94.23 40.13,94.23 41.66,92.71 41.66,80.26
N$1
  Top 0.635: R16.1 63.09,92.04 FAULT_LED.A
N$2
  Top 0.813: D2.2 39.18,32.07 U$6.5
N$3
  pour Top (no thermals): 30.23,38.86 30.23,41.91 30.73,42.42 34.29,42.42 35.81,43.94 41.15,43.94 41.15,38.86
  pour Top (no thermals): 36.32,41.66 37.47,42.8 33.78,46.48 33.78,51.31 31.5,51.31 31.5,48.51 32.77,47.24 32.77,41.66
  pour Top (no thermals): 30.48,41.4 30.48,39.37 32.51,39.37 33.02,39.37 35.31,41.66 30.73,41.66
N$4
  Top 1.27: Q5.1 21.84,77.22 24.64,77.22 28.11,73.75 R18.1 R4.2 30.13,73.92 Q7.1
N$5  (via drill 0.35)
  Top 0.203: v63.17,36.15 63.42,36.4 63.93,36.4 65.46,34.87 U$9.IN4
  Top 0.254: v70.87,80.52 71.19,80.52 73.3,82.64 73.3,83.58 73.29,83.6 v73.29,83.95 | v63.37,86.5 63.37,86.24 59.03,81.91 59.03,81.02 v58.78,80.77 | v53.59,80.77 53.34,80.52 53.32,80.52 51.41,78.61 51.41,77.47 v51.16,77.47
  Bottom 0.203: R8.1 63.5,36.48 v63.17,36.15
  Bottom 0.254: R8.1 62.74,37.25 62.01,37.98 62.01,40.35 64.16,42.5 64.16,62.23 66.19,64.26 68.75,64.26 68.99,64.5 68.99,66.46 66.72,68.73 66.29,68.73 66.04,68.99 66.04,77.47 69.34,80.77 70.61,80.77 v70.86,80.52 v70.87,80.52 | v73.29,83.95 72.9,84.34 72.9,86.27 72.41,86.77 63.64,86.77 v63.37,86.5 | v58.78,80.77 58.52,80.52 53.85,80.52 v53.59,80.77 | v51.16,77.47 51.16,60.56 45.32,54.72 45.32,46.99 45.22,46.89 44.18,46.89 44.03,46.74 43.69,46.74 43.43,46.48 43.43,44.45 45.17,42.71 R5.1
N$6
  Top 0.635: KILLSWITCH.C 70.02,11.94 R17.2
N$7
  Bottom 1.016: LIGHTING.3 75.65,46.04 Q3.2
N$8  (via drill 0.35)
  Top 0.508: v82.55,30.71 83.73,32 R20.1 | v68.83,25.52 68.83,24.52 67.59,23.28 64.61,23.28 v63.75,24.13
  Top 0.635: R20.1 83.54,32.15 T1.1
  Bottom 0.508: v82.55,30.71 82.57,30.71 82.53,29.21 73.91,29.21 73.91,28.45 70.98,25.52 v68.83,25.52 | v63.75,24.13 61.21,24.13 56.64,19.56 43.96,19.56 39.9,15.5 Q1.1
N$9
  Bottom 1.016: LIGHTING.4 74.07,35.06 Q2.2
N$10
  Top 0.813: D1.2 40.83,52.14 U$5.5
N$11  (via drill 0.35)
  Top 0.254: v63.77,35.31 64.02,35.31 65.1,34.22 U$9.IN3 68.76,34.22 68.76,31.26 R9.1
  Bottom 0.254: R6.1 61.98,36.07 62.74,35.31 v63.77,35.31
N$12
  Top 0.254: R7.1 64.06,33.57 U$9.IN2 67.78,33.57 68.07,33.27 68.07,32.26 66.38,30.57 R10.1
N$13
  Top 0.635: Q8.3 R4.1
N$14  (via drill 0.35)
  Top 0.61: v66.8,25.65 67.03,25.43 T3.1
  Bottom 0.61: R24.1 61.63,25.65 v66.8,25.65
N$16
  Bottom 0.508: Q4.1 65.14,29.3 C1.2 R25.1
  Bottom 0.635: R24.2 62.88,28.93 Q4.1
N$17
  Top 0.457: U$9.A1 73.48,36.82 R12.2
  Top 0.508: R12.2 R13.2
N$18
  Top 0.432: 5V.A R23.1
N$19
  Top 0.508: U$6.4 33.53,30.01 33.53,21.89 U$8.IP-2
  pour Top (no thermals): 39.37,13.21 39.37,18.54 38.35,19.56 35.56,19.56 33.02,22.1 33.02,22.61 30.73,22.61 30.73,17.27 34.8,13.21
N$20
  Top 1.016: R1.1 96.96,83.05 97.12,83.05 98.14,84.07 U3.6
N$21
  Top 0.635: R28.1 97.75,60.98 U1.6
N$22
  Top 0.635: Q9.3 70.38,62.89 U1.2
N$23
  Top 0.432: 12V.A R22.1
N$24
  Top 1.27: C13.+ 78.01,52.85 U1.1 70.38,47.56 L3.2
N$25
  Top 0.432: STBD.A R21.1
N$26
  Top 0.432: PORT.A R19.1
N$28
  Top 1.016: Q6.3 70.61,84.31 U3.2
N$29
  pour Top (no thermals): 79.76,75.95 79.76,78.74 79.5,78.99 69.6,78.99 68.83,78.23 68.83,72.64 71.63,69.85 75.18,69.85 80.01,74.68 80.01,75.69
N$30
  Bottom 0.635: IC4.2 50.55,83.31 49.78,82.55 46.65,82.55 R40.2 R39.2
N$31  (via drill 0.64)
  Top 0.635: v47.75,79.25 47.75,82.8 48.26,83.31 55.37,83.31 55.88,83.82 v55.88,85.85
  Bottom 0.635: R43.2 49.87,85.85 IC4.4 v55.88,85.85 | R44.2 36.07,49.28 47.75,60.96 v47.75,79.25
N$32
  Bottom 0.635: IC4.13 58.56,82.84 59.04,82.84 59.07,82.8 R46.1 R45.2
N$33  (via drill 0.64)
  Top 0.635: v45.47,79.25 45.47,83.75 46.3,84.58 v54.61,84.58
  Bottom 0.635: R42.2 49.36,84.58 IC4.3 v54.61,84.58 | R41.2 33.78,50.22 45.47,61.91 v45.47,79.25
N$34  (via drill 0.64)
  Top 0.635: v54.61,87.12 56.64,87.12 56.9,86.87 56.9,80.1 R48.2
  Bottom 0.635: R47.2 50.46,87.12 IC4.5 v54.61,87.12
N$36
  Bottom 0.635: IC4.6 IC4.9
N$37
  Bottom 0.635: IC4.12 IC4.11 IC4.10
N$39  (via drill 0.35)
  Top 0.152: v65.47,35.75 65.7,35.52 U$9.IN5
  Bottom 0.152: R14.1 57.91,31.84 R11.1 62.4,31.84 62.95,31.28 64.56,31.28 65.47,32.19 65.47,32.74 65.18,33.03 65.18,34.63 65.19,34.65 65.19,35.48 v65.47,35.75
N$40  (via drill 0.35)
  Top 0.254: U$9.IN6 67.41,36.17 67.82,36.58 67.82,37.08 67.56,37.34 67.09,37.34 R15.1 66.46,37.76 v65.53,36.83
  Bottom 0.254: R26.1 v65.53,36.83
OUT
  cutout Top: 63.25,19.81 62.99,19.56 62.99,14.48 64.52,14.48 64.77,14.73 64.77,19.56 64.26,20.07 63.5,20.07
PLTA_ALT
  Bottom 0.508: Q1.3 48.97,17.26 70.07,17.26 71.88,19.07 71.88,24.38 75.18,27.69 80.28,27.69 MYNT_XAVIER_PLTA.8
PLTA_SWITCH  (via drill 0.35)
  Top 0.508: T1.3 82.3,28.43 v81.53,28.43 | U$1.50 31.82,8.45 33.27,9.91 v42.67,9.91
  Bottom 0.508: v81.53,28.43 74.7,28.43 74.68,28.45 74.57,28.35 74.57,28.17 71.14,24.74 71.14,21.77 70.16,20.79 70.16,18.36 69.83,18.03 53.09,18.03 52.32,18.8 44.7,18.8 44.51,18.6 43.94,18.6 43.7,18.36 43.7,18.3 41.4,16 41.4,11.78 40.87,11.25 40.87,10.6 41.33,10.14 42.44,10.14 v42.67,9.91
PORT_BAT  (via drill 0.35)
  Top 0.254: v26.67,38.61 27.18,38.1 29.14,38.1 29.3,38.25 40.98,38.25 41.91,39.18 v41.91,39.88 | v50.04,77.47 50.04,78.23 52.42,80.61 v52.48,80.61 | v57.91,81.19 57.91,81.36 57.91,82.3 v62.23,86.61 | v73.91,84.84 73.91,84.26 73.94,84.23 73.94,82.33 v71.88,80.26 | v72.9,28.96 72.9,24.64 74.94,22.59 PORT.C
  Bottom 0.254: R5.2 42.46,39.88 v41.91,39.88 36.49,39.88 R41.1 34.62,42.58 35.4,43.36 37.2,43.36 37.42,43.59 41.81,43.59 43.03,44.81 43.03,46.65 44.91,48.54 44.91,55.33 50.75,61.17 50.75,76.76 v50.04,77.47 | v52.48,80.61 52.51,80.61 53.32,81.43 53.87,81.43 54.11,81.19 v57.91,81.19 | v73.91,84.84 73.3,85.45 73.3,86.44 72.57,87.17 63.11,87.17 62.55,86.61 v62.23,86.61 | v71.88,80.26 71.48,79.86 70.59,79.86 70.45,80.01 69.34,80.01 66.8,77.47 66.8,69.22 69.39,66.63 69.39,64.33 69.09,64.03 69.09,64.01 68.83,63.75 66.29,63.75 64.57,62.03 64.57,42.22 62.48,40.13 62.48,38.35 62.74,38.1 64.35,38.1 64.58,37.87 64.58,34.63 55.38,34.63 53.04,32.3 52.98,32.3 52.51,31.83 52.51,29.41 52.58,29.35 52.58,20.32 55.88,20.32 60.64,25.08 60.64,26.44 60.8,26.6 62.13,26.6 62.38,26.35 71.06,26.35 72.9,28.19 v72.9,28.96
  pour Top (no thermals): 18.54,48.51 18.03,48.01 18.03,32 23.11,32 23.62,32.51 23.62,47.75 22.86,48.51
  pour Top (no thermals): 23.62,41.4 29.46,41.4 29.72,41.15 29.72,39.37 29.46,39.12 23.62,39.12
  pour Top (no thermals): 18.54,48.51 22.86,48.51 24.89,46.48 24.89,44.45 25.4,43.94 26.67,43.94 29.72,43.94 29.72,39.12 29.21,39.12 27.43,37.34 27.18,37.08 27.18,32.51 26.67,32 18.03,32 18.03,48.01
PORT_CURRENT  (via drill 0.35, 0.64)
  Top 0.457: U$9.IN1 66.63,32.83 66.12,32.83 65.8,32.51 v64.78,32.51
  Top 0.635: U$7.VIOUT 29.34,46.86 v28.7,47.5 | v49.28,36.87 49.53,37.12 53.54,37.12 53.54,31.98 53.31,31.75 v53.31,31.5
  Bottom 0.457: v64.78,32.51 63.25,34.05 63.25,34.04
  Bottom 0.635: v28.7,47.5 28.96,47.5 29.46,48.01 31.75,48.01 32.51,47.24 32.51,41.66 36.58,37.59 48.98,37.59 49.49,37.08 v49.28,36.87 | v53.31,31.5 53.31,31.73 55.63,34.04 63.25,34.04
SENSOR_SCL  (via drill 0.35)
  Top 0.254: U$9.SCL 72.94,33.57 73.41,34.04
  Top 0.508: U$1.29 85.16,8.2 v85.34,8.38 | v84.07,38.94 80.28,38.94 75.38,34.04 73.41,34.04 | v90.93,38.94 95.75,38.94 99.82,34.86 v99.82,10.16
  Bottom 0.508: v85.34,8.38 86.18,9.22 98.88,9.22 v99.82,10.16 | v90.93,38.94 v84.07,38.94
SENSOR_SDA  (via drill 0.35)
  Top 0.254: U$9.SDA 72.67,33.12 73.04,33.12 73.07,33.15 75.24,33.15 80.45,38.35 83.72,38.35 83.8,38.28 83.82,38.28 v84.07,38.03
  Top 0.508: U$1.30 82.62,8.45 83.77,9.6 97.23,9.6 99.06,11.43 99.06,34.54 95.58,38.03 v90.93,38.03
  Bottom 0.508: v90.93,38.03 v84.07,38.03
STBD_BAT  (via drill 0.35)
  Top 0.254: v70.87,81.43 71.52,81.43 72.9,82.8 72.9,83.06 v72.64,83.31 | v64.01,85.85 64.01,85.6 59.44,81.03 59.44,80.25 59.29,80.1 v59.29,79.86 | v53.59,79.86 51.82,78.08 51.82,77.47 v52.07,77.47 | v44.45,46.23 44.45,45.21 43.43,44.2 v43.43,43.18 43.43,39.62 41.66,37.85 29.46,37.85 28.19,36.58 28.19,33.02 24.57,29.4 BATTERYCONNECTOR.12 | STBD.C 74.31,24.76 v74.31,30 | v69.05,36.18 68.73,36.5 68.73,38.76 68.42,38.76 v68.18,39 | v69.34,27.18 68.67,27.18 66.91,28.94 66.91,30.08 67.5,30.68 v67.5,30.73
  Bottom 0.254: R44.1 37,42.58 37.59,43.18 v43.43,43.18 | R6.2 58.93,36.07 57.66,37.34 57.66,38.35 59.69,40.39 61.47,40.39 63.75,42.67 63.75,62.4 66.02,64.67 68.58,64.67 68.58,66.29 66.55,68.33 66.13,68.33 65.63,68.82 65.63,77.64 69.17,81.18 70.61,81.18 v70.86,81.43 | v70.86,81.43 v70.87,81.43 | v72.64,83.31 72.49,83.46 72.49,86.11 72.24,86.36 64.52,86.36 v64.01,85.85 | v59.29,79.86 53.84,79.86 53.59,80.11 v53.59,79.86 | v52.07,77.47 52.07,60.18 46.23,54.34 46.23,46.99 45.47,46.23 v44.45,46.23 | v70.86,81.43 71.11,81.18 71.9,81.18 72.54,80.54 72.54,79.99 72.39,79.84 72.39,79.5 71.69,79.5 71.65,79.46 70.42,79.46 70.38,79.5 69.6,79.5 67.28,77.19 67.28,69.31 69.8,66.8 69.8,64.14 65.02,59.37 65.02,42.15 v68.18,39 | v69.05,36.18 69.05,35.16 69.34,35.16 69.34,33.54 69.37,33.51 69.37,30.84 69.26,30.73 v67.5,30.73 | v74.31,30 74.08,30.23 73.15,30.23 73.05,30.12 73.05,30.1 71.25,28.3 71.14,28.3 69.85,27.01 69.51,27.01 v69.34,27.18
  pour Top (no thermals): 18.29,30.99 23.37,30.99 23.88,30.48 23.88,16.51 22.35,14.99 19.05,14.99 18.03,16 18.03,30.73
  pour Top (no thermals): 30.23,17.27 30.23,22.61 27.94,24.89 27.94,28.96 25.91,30.99 18.03,30.99 17.78,30.73 17.78,14.22 18.29,13.72 26.67,13.72
STBD_CURRENT  (via drill 0.64)
  Top 0.356: v63.73,32.26 63.75,31.86 63.88,31.71 66.16,31.71 U$9.IN0
  Top 0.508: v46.99,36.32 48.51,36.32 48.99,35.84 51.54,35.84 52.32,35.05 52.32,29.97 52.58,29.72 v53.34,29.72
  Top 0.635: U$8.VIOUT 29.84,28.07 v29.97,28.19
  Bottom 0.508: v53.34,29.72 56.64,33.02 62.74,33.02 63.78,31.98 v63.73,32.26
  Bottom 0.635: v29.97,28.19 29.97,32.77 33.78,36.58 46.74,36.58 v46.99,36.32
V+
  pour Top (no thermals): 17.27,67.06 17.27,54.36 25.65,54.36 27.18,52.83 33.27,52.83 34.04,53.59 34.04,61.21 51.56,61.21 51.56,46.48 45.97,46.48 45.97,37.59 54.1,37.59 54.1,20.57 52.32,18.8 46.48,18.8 46.48,12.95 46.74,12.7 64.39,12.7 64.39,38.99 67.82,42.42 67.82,48.26 66.8,49.28 66.8,77.72 65.53,78.99 54.61,78.99 52.32,76.71 36.83,76.71 35.05,74.93 35.05,71.88 33.53,71.88 32.77,72.64 27.43,72.64 24.13,75.95 22.61,75.95 19.56,72.9 19.56,69.34
  pour Top (no thermals): 33.02,32.77 28.7,32.77 28.45,33.02 28.45,36.32 29.72,37.59 41.66,37.59 44.7,40.64 44.7,45.21 45.97,46.48 48.01,46.48 48.01,38.35 45.72,36.07 33.78,36.07 33.02,35.31
XAVIER_ALT  (via drill 0.35)
  Top 1.016: v64.52,7.87 v62.48,9.91 | v62.99,13.46 63.75,14.22 v63.75,19.3
  Bottom 1.016: MYNT_XAVIER_PLTA.5 79.57,13.27 74.17,7.87 v64.52,7.87 | v62.48,9.91 62.48,11.57 62.46,11.59 62.46,12.93 v62.99,13.46 | v63.75,19.3 65.79,21.34 67.06,21.34 Q4.3
XAVIER_SWITCH  (via drill 0.35)
  Top 1.016: T3.3 66.06,17.66 65.82,17.42 65.82,14.26 v65.28,13.72
  Bottom 1.016: U$1.19 62.3,7.44 62.74,7.87 65.28,10.41 v65.28,13.72

### Text on the board
tPlace: The Underwater Robotics Team / Center for Automotive Research | Lighting 1 | Lighting 2 | vGND | --------PORT | PLTA | --------GND-------- | 5V | 3V3 | STBD-------- | XAVIER | ^GND
bPlace: 12V | V+
tNames: ESC | Xavier_PLTA
_tNames: R16 | R3 | AO3404A | R1 | C17 | R2 | C15 | R4 | R48 | C16 | R18 | L2 | R33 | R32 | AO3404A | C13 | C11 | LM5050 | C10 | C9 | ACS722 | LM5050 | C6 | ACS722 | R21 | R19 | R23 | C4 | C3 | C2 | R17
_bNames: R47 | R43 | R39 | R40 | R45 | R42 | R46 | R41 | R44 | R5